# EAGLE design EIT_Recorder (EAGLE 9.6.2)

## Sheet 1 of 8: ADC_1
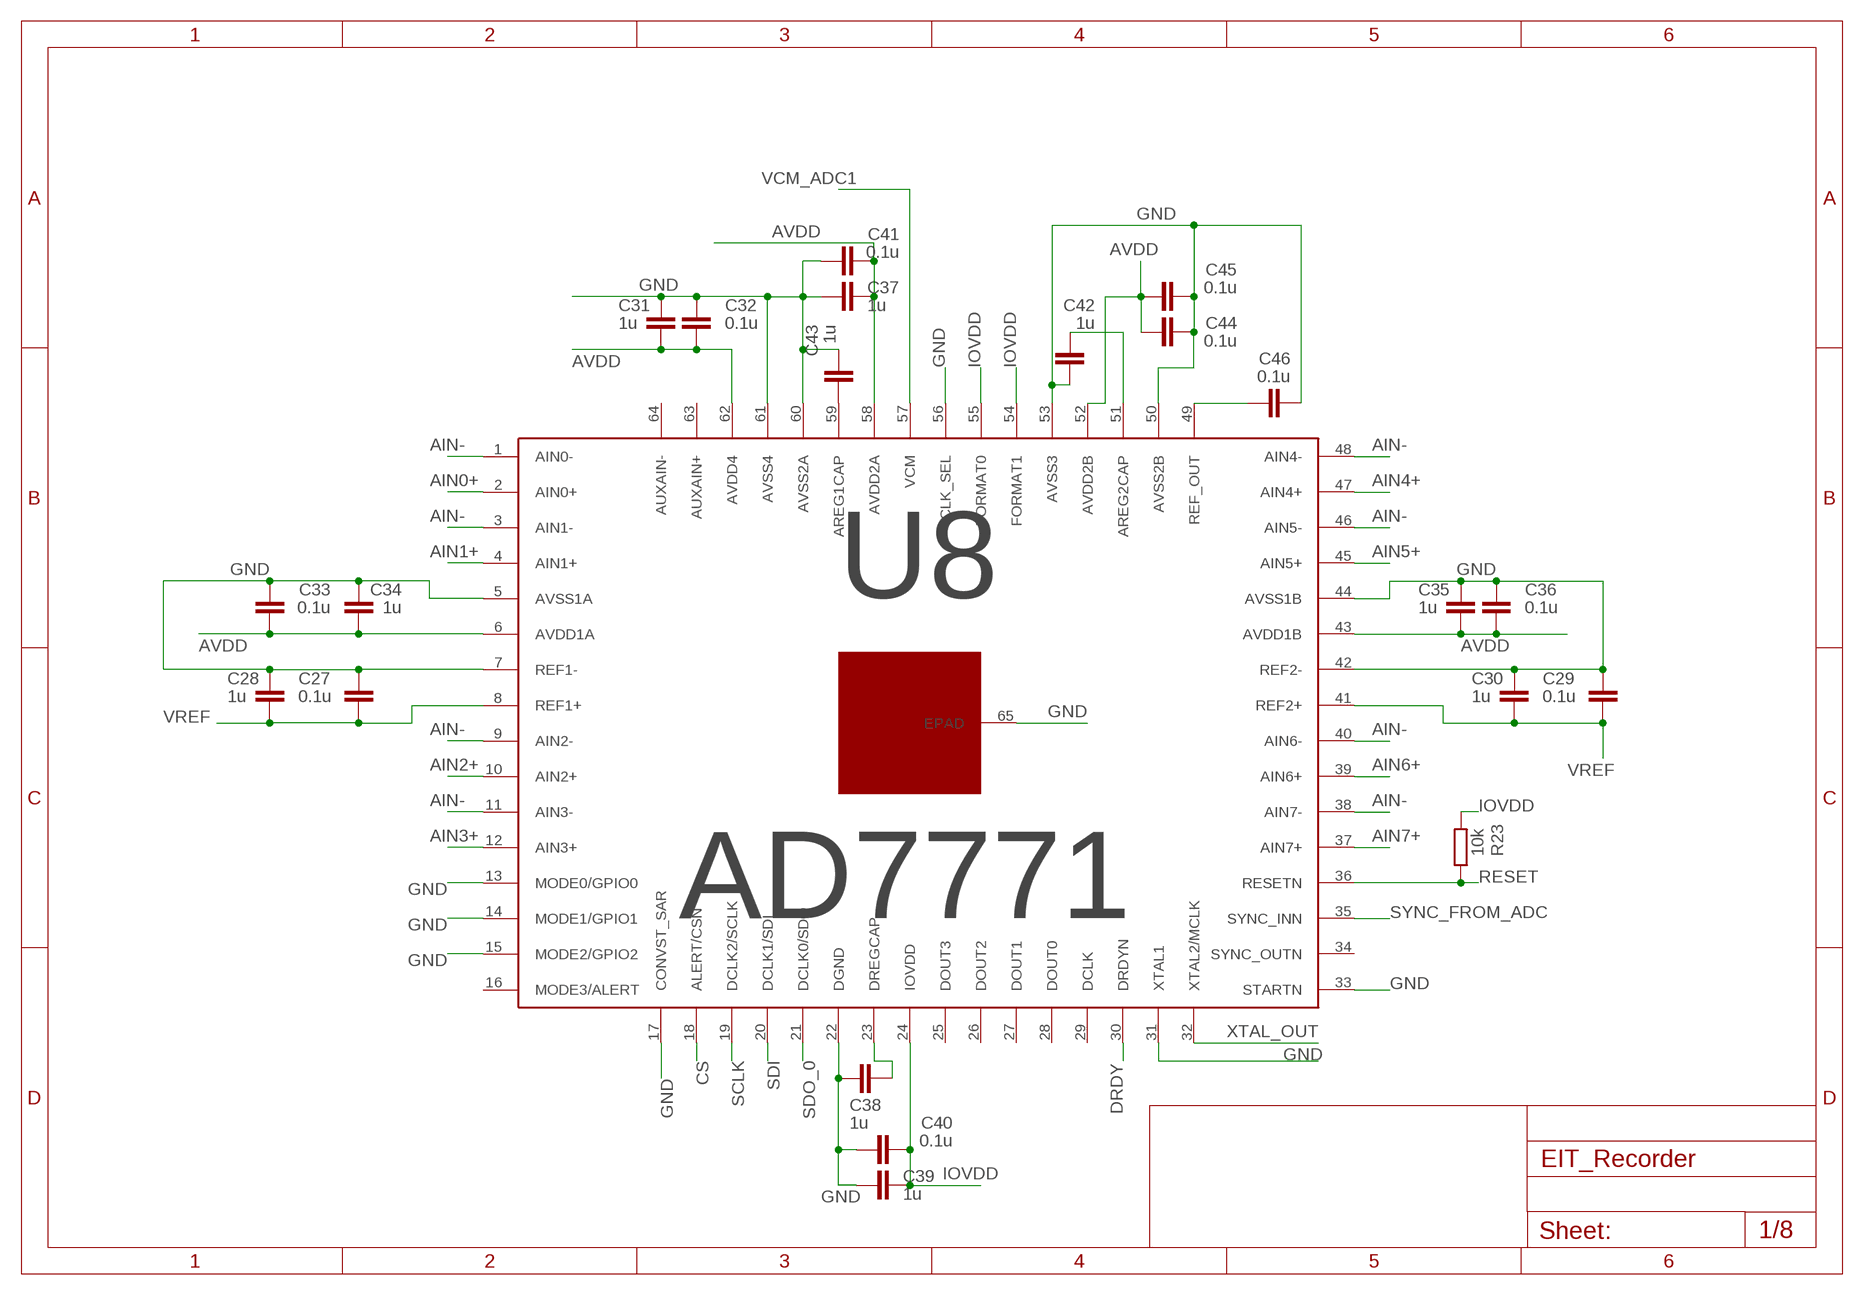
[diagram p0: schematic, sheet 1]

### Parts
C27  0.1u  C0402  [C0402]
C28  1u  C0402  [C0402]
C29  0.1u  C0402  [C0402]
C30  1u  C0402  [C0402]
C31  1u  C0402  [C0402]
C32  0.1u  C0402  [C0402]
C33  0.1u  C0402  [C0402]
C34  1u  C0402  [C0402]
C35  1u  C0402  [C0402]
C36  0.1u  C0402  [C0402]
C37  1u  C0402  [C0402]
C38  1u  C0402  [C0402]
C39  1u  C0402  [C0402]
C40  0.1u  C0402  [C0402]
C41  0.1u  C0402  [C0402]
C42  1u  C0402  [C0402]
C43  1u  C0402  [C0402]
C44  0.1u  C0402  [C0402]
C45  0.1u  C0402  [C0402]
C46  0.1u  C0402  [C0402]
R23  10k  R0603  [R0603]
U8  AD7771  [LFCSP64_CUSTOM]

### Nets
AIN0+: U8.2(AIN0+) ; also sheet 7
AIN1+: U8.4(AIN1+) ; also sheet 7
AIN2+: U8.10(AIN2+) ; also sheet 7
AIN3+: U8.12(AIN3+) ; also sheet 7
AIN4+: U8.47(AIN4+) ; also sheet 7
AIN5+: U8.45(AIN5+) ; also sheet 7
AIN6+: U8.39(AIN6+) ; also sheet 7
AIN7+: U8.37(AIN7+) ; also sheet 7
AIN-: U8.1(AIN0-) U8.3(AIN1-) U8.9(AIN2-) U8.11(AIN3-) U8.38(AIN7-) U8.40(AIN6-) U8.46(AIN5-) U8.48(AIN4-) ; also sheet 2,3,4,7
AVDD: C31.1 C32.1 C33.1 C34.1 C35.1 C36.1 C37.1 C41.1 C44.2 C45.2 U8.6(AVDD1A) U8.43(AVDD1B) U8.52(AVDD2B) U8.58(AVDD2A) U8.62(AVDD4) ; also sheet 2,3,4,5
CS: U8.18(ALERT/CSN) ; also sheet 2,3,4,8
DRDY: U8.30(DRDYN) ; also sheet 8
GND: C27.2 C28.2 C29.2 C30.2 C31.2 C32.2 C33.2 C34.2 C35.2 C36.2 C37.2 C38.1 C39.2 C40.2 C41.2 C42.2 C43.1 C44.1 C45.1 C46.1 U8.5(AVSS1A) U8.7(REF1-) U8.13(MODE0/GPIO0) U8.14(MODE1/GPIO1) U8.15(MODE2/GPIO2) U8.17(CONVST_SAR) U8.22(DGND) U8.31(XTAL1) U8.33(STARTN) U8.42(REF2-) U8.44(AVSS1B) U8.50(AVSS2B) U8.53(AVSS3) U8.56(CLK_SEL) U8.60(AVSS2A) U8.61(AVSS4) U8.65(EPAD) ; also sheet 2,3,4,5,6,7,8
IOVDD: C39.1 C40.1 R23.2 U8.24(IOVDD) U8.54(FORMAT1) U8.55(FORMAT0) ; also sheet 2,3,4,5,6,8
N$41: C43.2 U8.59(AREG1CAP)
N$43: C38.2 U8.23(DREGCAP)
N$44: C46.2 U8.49(REF_OUT)
N$47: C42.1 U8.51(AREG2CAP)
RESET: R23.1 U8.36(RESETN) ; also sheet 2,3,4,8
SCLK: U8.19(DCLK2/SCLK) ; also sheet 2,3,4,8
SDI: U8.20(DCLK1/SDI) ; also sheet 2,3,4,8
SDO_0: U8.21(DCLK0/SDO) ; also sheet 8
SYNC_FROM_ADC: U8.35(SYNC_INN) ; also sheet 2,3,4
VCM_ADC1: U8.57(VCM) ; also sheet 7
VREF: C27.1 C28.1 C29.1 C30.1 U8.8(REF1+) U8.41(REF2+) ; also sheet 2,3,4,7
XTAL_OUT: U8.32(XTAL2/MCLK) ; also sheet 2,3,4,6
Unconnected: U8.16(MODE3/ALERT) U8.25(DOUT3) U8.26(DOUT2) U8.27(DOUT1) U8.28(DOUT0) U8.29(DCLK) U8.34(SYNC_OUTN) U8.63(AUXAIN+) U8.64(AUXAIN-)

## Sheet 2 of 8: ADC_2
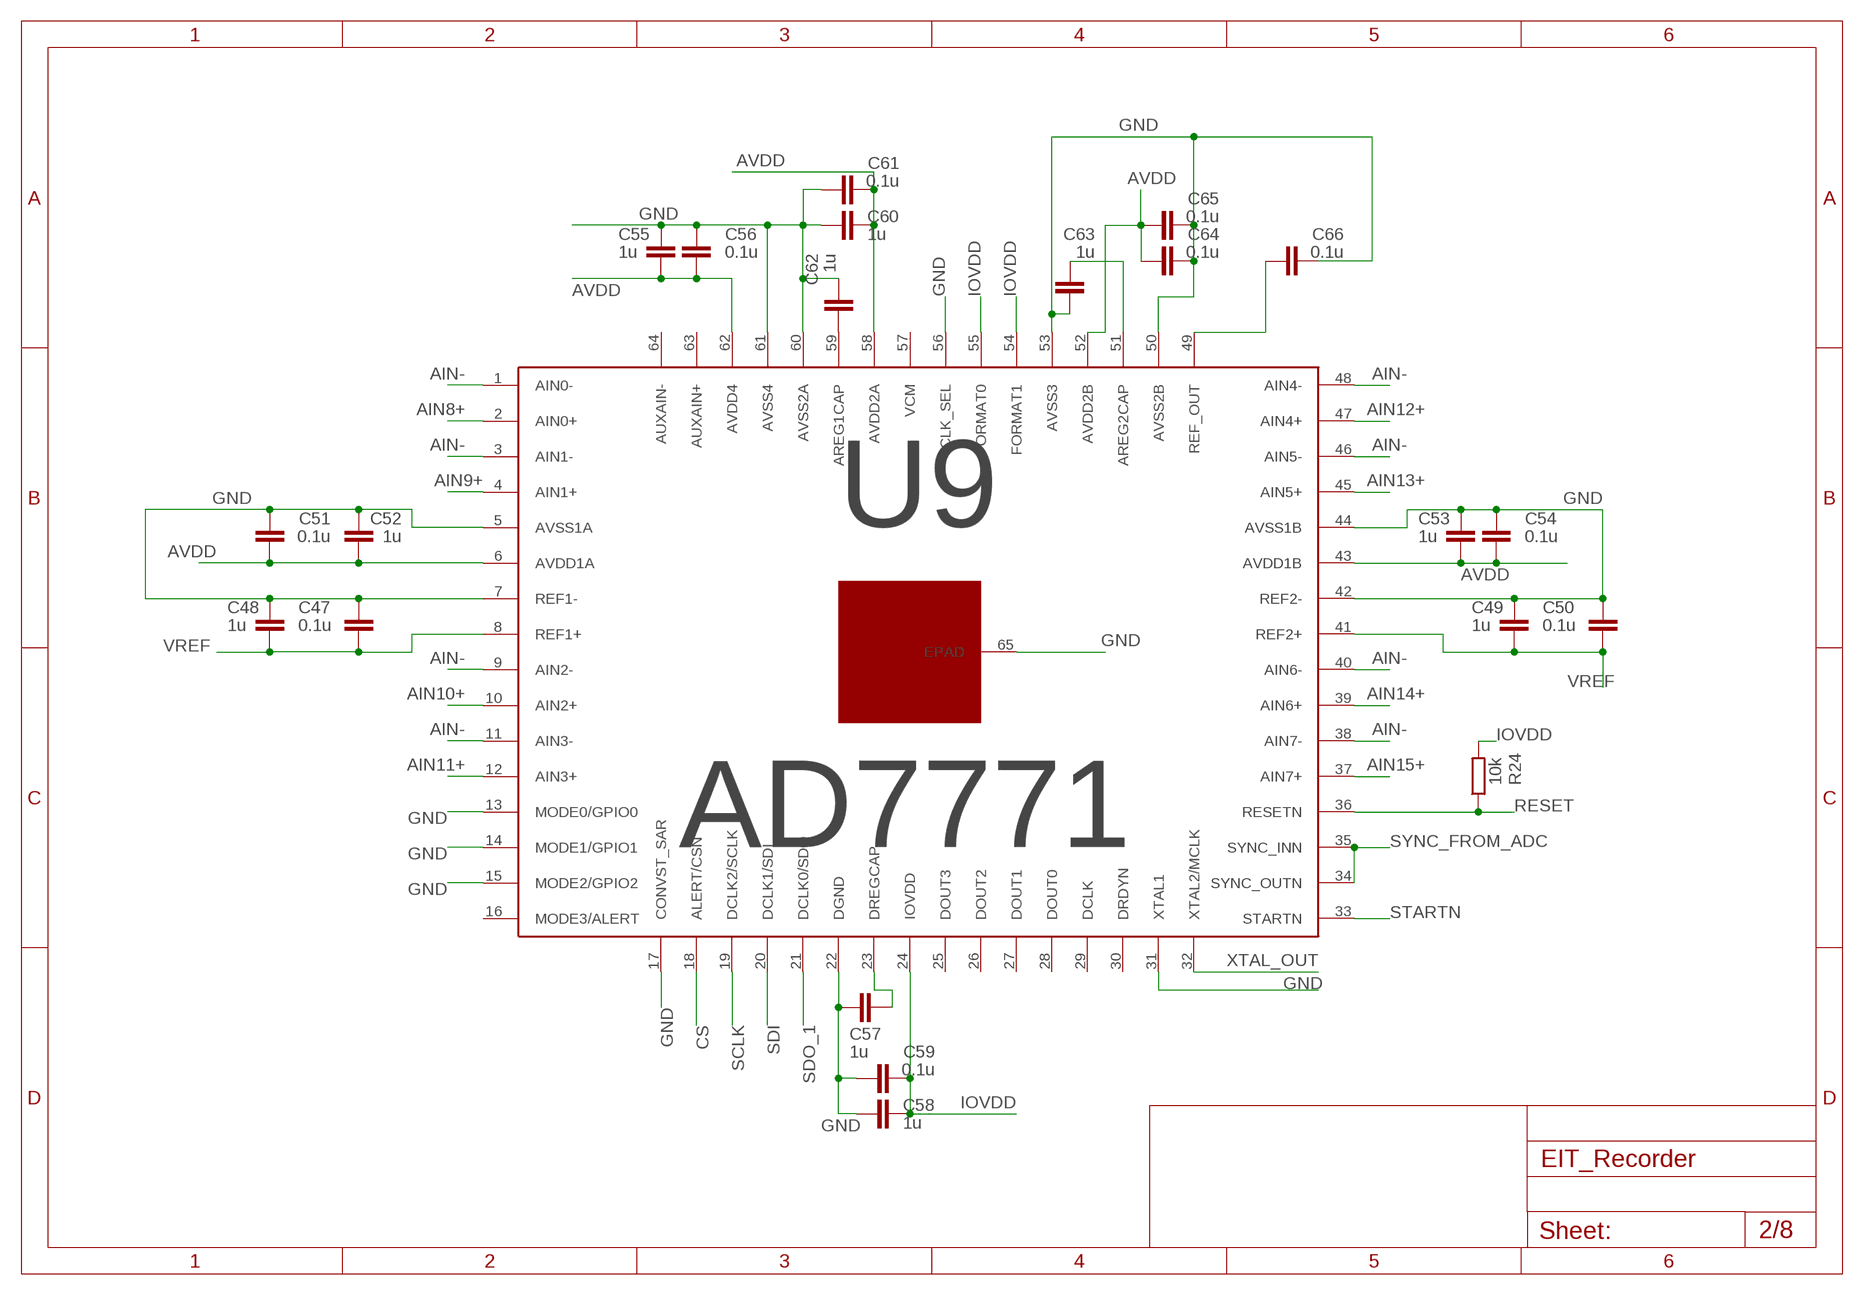
[diagram p1: schematic, sheet 2]

### Parts
C47  0.1u  C0402  [C0402]
C48  1u  C0402  [C0402]
C49  1u  C0402  [C0402]
C50  0.1u  C0402  [C0402]
C51  0.1u  C0402  [C0402]
C52  1u  C0402  [C0402]
C53  1u  C0402  [C0402]
C54  0.1u  C0402  [C0402]
C55  1u  C0402  [C0402]
C56  0.1u  C0402  [C0402]
C57  1u  C0402  [C0402]
C58  1u  C0402  [C0402]
C59  0.1u  C0402  [C0402]
C60  1u  C0402  [C0402]
C61  0.1u  C0402  [C0402]
C62  1u  C0402  [C0402]
C63  1u  C0402  [C0402]
C64  0.1u  C0402  [C0402]
C65  0.1u  C0402  [C0402]
C66  0.1u  C0402  [C0402]
R24  10k  R0603  [R0603]
U9  AD7771  [LFCSP64_CUSTOM]

### Nets
AIN8+: U9.2(AIN0+) ; also sheet 7
AIN9+: U9.4(AIN1+) ; also sheet 7
AIN10+: U9.10(AIN2+) ; also sheet 7
AIN11+: U9.12(AIN3+) ; also sheet 7
AIN12+: U9.47(AIN4+) ; also sheet 7
AIN13+: U9.45(AIN5+) ; also sheet 7
AIN14+: U9.39(AIN6+) ; also sheet 7
AIN15+: U9.37(AIN7+) ; also sheet 7
AIN-: U9.1(AIN0-) U9.3(AIN1-) U9.9(AIN2-) U9.11(AIN3-) U9.38(AIN7-) U9.40(AIN6-) U9.46(AIN5-) U9.48(AIN4-) ; also sheet 1,3,4,7
AVDD: C51.1 C52.1 C53.1 C54.1 C55.1 C56.1 C60.1 C61.1 C64.2 C65.2 U9.6(AVDD1A) U9.43(AVDD1B) U9.52(AVDD2B) U9.58(AVDD2A) U9.62(AVDD4) ; also sheet 1,3,4,5
CS: U9.18(ALERT/CSN) ; also sheet 1,3,4,8
GND: C47.2 C48.2 C49.2 C50.2 C51.2 C52.2 C53.2 C54.2 C55.2 C56.2 C57.1 C58.2 C59.2 C60.2 C61.2 C62.1 C63.2 C64.1 C65.1 C66.1 U9.5(AVSS1A) U9.7(REF1-) U9.13(MODE0/GPIO0) U9.14(MODE1/GPIO1) U9.15(MODE2/GPIO2) U9.17(CONVST_SAR) U9.22(DGND) U9.31(XTAL1) U9.42(REF2-) U9.44(AVSS1B) U9.50(AVSS2B) U9.53(AVSS3) U9.56(CLK_SEL) U9.60(AVSS2A) U9.61(AVSS4) U9.65(EPAD) ; also sheet 1,3,4,5,6,7,8
IOVDD: C58.1 C59.1 R24.2 U9.24(IOVDD) U9.54(FORMAT1) U9.55(FORMAT0) ; also sheet 1,3,4,5,6,8
N$39: C57.2 U9.23(DREGCAP)
N$57: C62.2 U9.59(AREG1CAP)
N$61: C63.1 U9.51(AREG2CAP)
N$64: C66.2 U9.49(REF_OUT)
RESET: R24.1 U9.36(RESETN) ; also sheet 1,3,4,8
SCLK: U9.19(DCLK2/SCLK) ; also sheet 1,3,4,8
SDI: U9.20(DCLK1/SDI) ; also sheet 1,3,4,8
SDO_1: U9.21(DCLK0/SDO) ; also sheet 8
STARTN: U9.33(STARTN) ; also sheet 8
SYNC_FROM_ADC: U9.34(SYNC_OUTN) U9.35(SYNC_INN) ; also sheet 1,3,4
VREF: C47.1 C48.1 C49.1 C50.1 U9.8(REF1+) U9.41(REF2+) ; also sheet 1,3,4,7
XTAL_OUT: U9.32(XTAL2/MCLK) ; also sheet 1,3,4,6
Unconnected: U9.16(MODE3/ALERT) U9.25(DOUT3) U9.26(DOUT2) U9.27(DOUT1) U9.28(DOUT0) U9.29(DCLK) U9.30(DRDYN) U9.57(VCM) U9.63(AUXAIN+) U9.64(AUXAIN-)

## Sheet 3 of 8: ADC_3
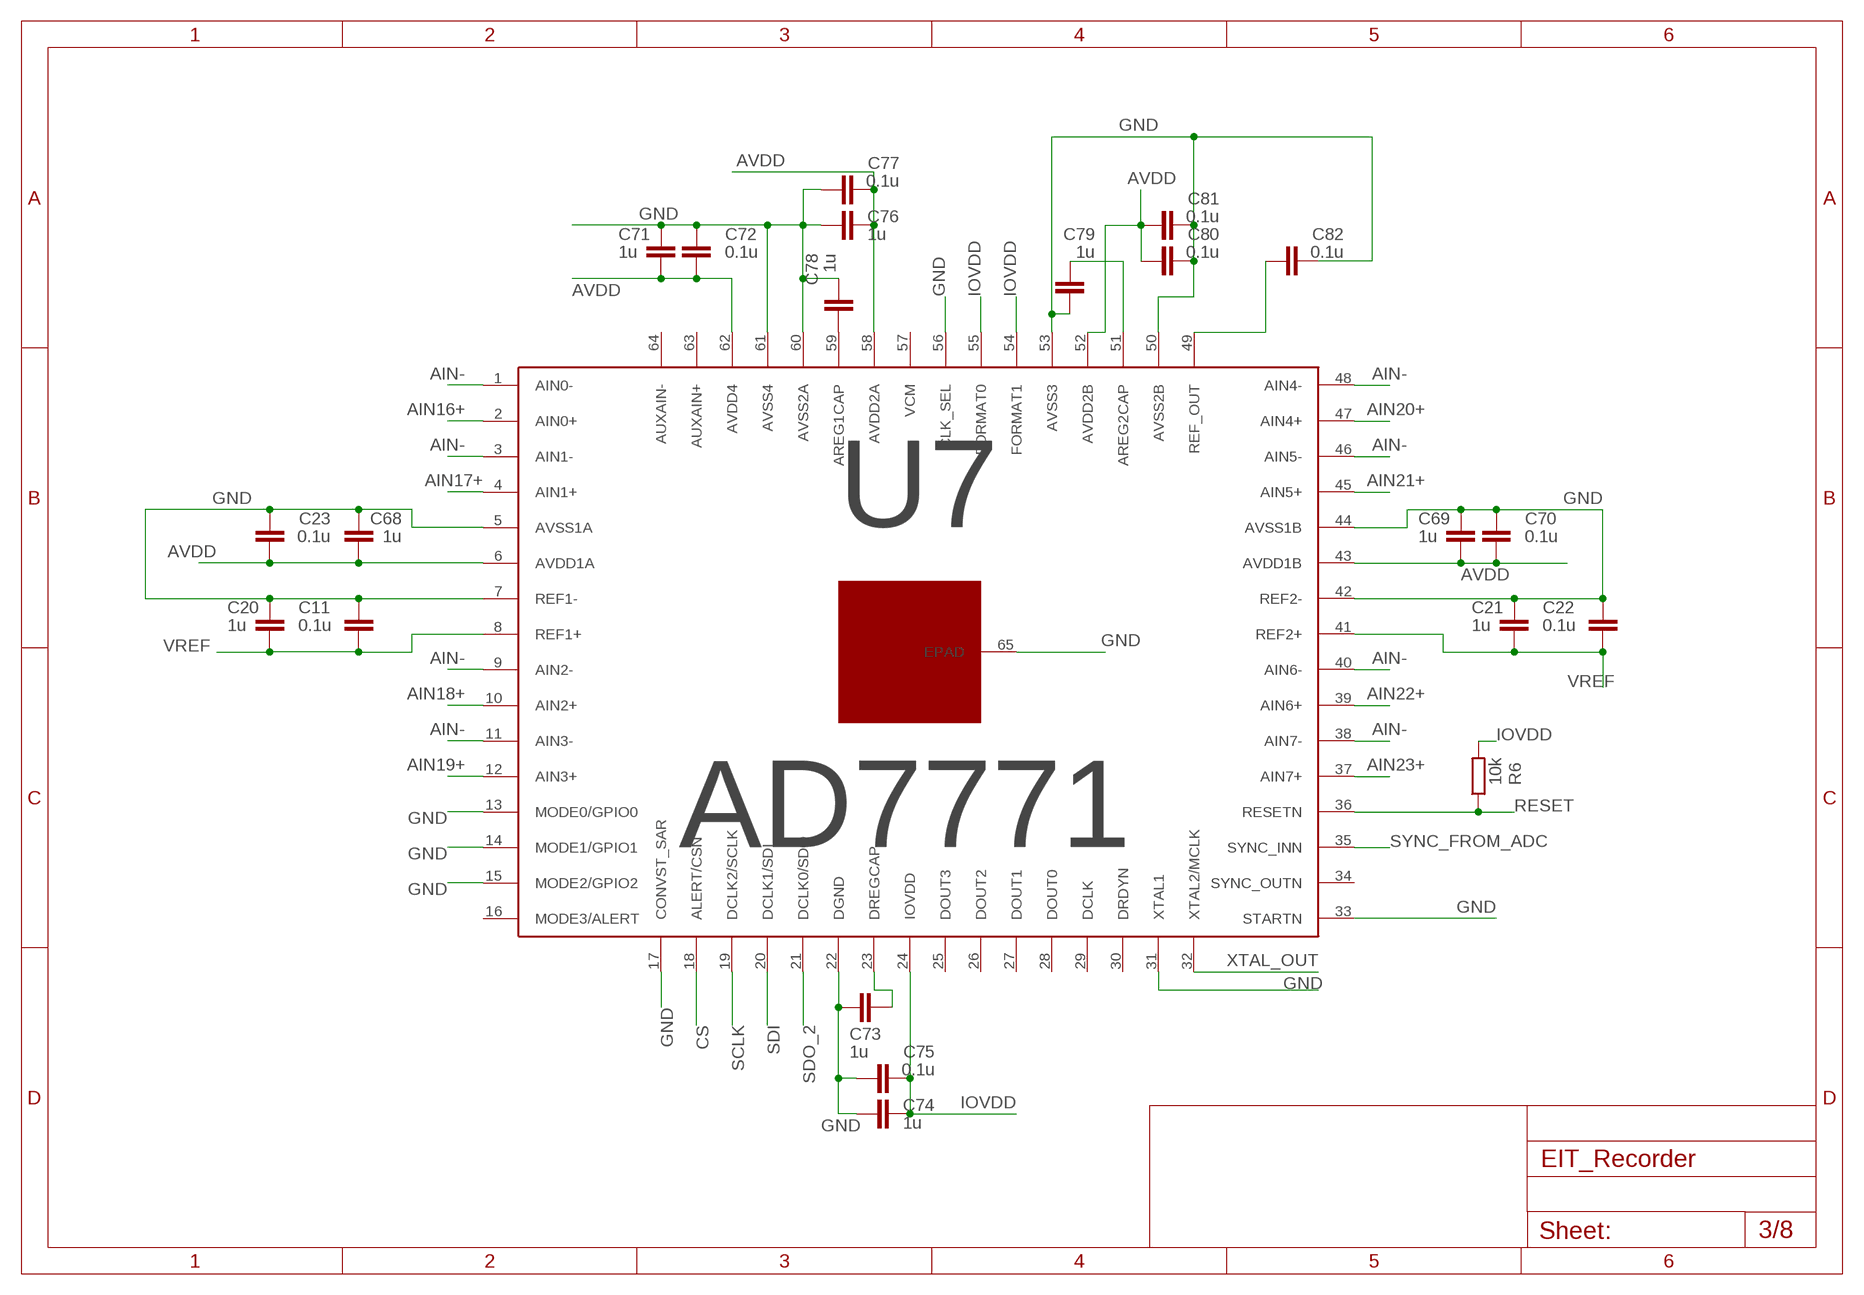
[diagram p2: schematic, sheet 3]

### Parts
C11  0.1u  C0402  [C0402]
C20  1u  C0402  [C0402]
C21  1u  C0402  [C0402]
C22  0.1u  C0402  [C0402]
C23  0.1u  C0402  [C0402]
C68  1u  C0402  [C0402]
C69  1u  C0402  [C0402]
C70  0.1u  C0402  [C0402]
C71  1u  C0402  [C0402]
C72  0.1u  C0402  [C0402]
C73  1u  C0402  [C0402]
C74  1u  C0402  [C0402]
C75  0.1u  C0402  [C0402]
C76  1u  C0402  [C0402]
C77  0.1u  C0402  [C0402]
C78  1u  C0402  [C0402]
C79  1u  C0402  [C0402]
C80  0.1u  C0402  [C0402]
C81  0.1u  C0402  [C0402]
C82  0.1u  C0402  [C0402]
R6  10k  R0603  [R0603]
U7  AD7771  [LFCSP64_CUSTOM]

### Nets
AIN16+: U7.2(AIN0+) ; also sheet 7
AIN17+: U7.4(AIN1+) ; also sheet 7
AIN18+: U7.10(AIN2+) ; also sheet 7
AIN19+: U7.12(AIN3+) ; also sheet 7
AIN20+: U7.47(AIN4+) ; also sheet 7
AIN21+: U7.45(AIN5+) ; also sheet 7
AIN22+: U7.39(AIN6+) ; also sheet 7
AIN23+: U7.37(AIN7+) ; also sheet 7
AIN-: U7.1(AIN0-) U7.3(AIN1-) U7.9(AIN2-) U7.11(AIN3-) U7.38(AIN7-) U7.40(AIN6-) U7.46(AIN5-) U7.48(AIN4-) ; also sheet 1,2,4,7
AVDD: C23.1 C68.1 C69.1 C70.1 C71.1 C72.1 C76.1 C77.1 C80.2 C81.2 U7.6(AVDD1A) U7.43(AVDD1B) U7.52(AVDD2B) U7.58(AVDD2A) U7.62(AVDD4) ; also sheet 1,2,4,5
CS: U7.18(ALERT/CSN) ; also sheet 1,2,4,8
GND: C11.2 C20.2 C21.2 C22.2 C23.2 C68.2 C69.2 C70.2 C71.2 C72.2 C73.1 C74.2 C75.2 C76.2 C77.2 C78.1 C79.2 C80.1 C81.1 C82.1 U7.5(AVSS1A) U7.7(REF1-) U7.13(MODE0/GPIO0) U7.14(MODE1/GPIO1) U7.15(MODE2/GPIO2) U7.17(CONVST_SAR) U7.22(DGND) U7.31(XTAL1) U7.33(STARTN) U7.42(REF2-) U7.44(AVSS1B) U7.50(AVSS2B) U7.53(AVSS3) U7.56(CLK_SEL) U7.60(AVSS2A) U7.61(AVSS4) U7.65(EPAD) ; also sheet 1,2,4,5,6,7,8
IOVDD: C74.1 C75.1 R6.2 U7.24(IOVDD) U7.54(FORMAT1) U7.55(FORMAT0) ; also sheet 1,2,4,5,6,8
N$15: C73.2 U7.23(DREGCAP)
N$16: C78.2 U7.59(AREG1CAP)
N$17: C79.1 U7.51(AREG2CAP)
N$18: C82.2 U7.49(REF_OUT)
RESET: R6.1 U7.36(RESETN) ; also sheet 1,2,4,8
SCLK: U7.19(DCLK2/SCLK) ; also sheet 1,2,4,8
SDI: U7.20(DCLK1/SDI) ; also sheet 1,2,4,8
SDO_2: U7.21(DCLK0/SDO) ; also sheet 8
SYNC_FROM_ADC: U7.35(SYNC_INN) ; also sheet 1,2,4
VREF: C11.1 C20.1 C21.1 C22.1 U7.8(REF1+) U7.41(REF2+) ; also sheet 1,2,4,7
XTAL_OUT: U7.32(XTAL2/MCLK) ; also sheet 1,2,4,6
Unconnected: U7.16(MODE3/ALERT) U7.25(DOUT3) U7.26(DOUT2) U7.27(DOUT1) U7.28(DOUT0) U7.29(DCLK) U7.30(DRDYN) U7.34(SYNC_OUTN) U7.57(VCM) U7.63(AUXAIN+) U7.64(AUXAIN-)

## Sheet 4 of 8: ADC_4
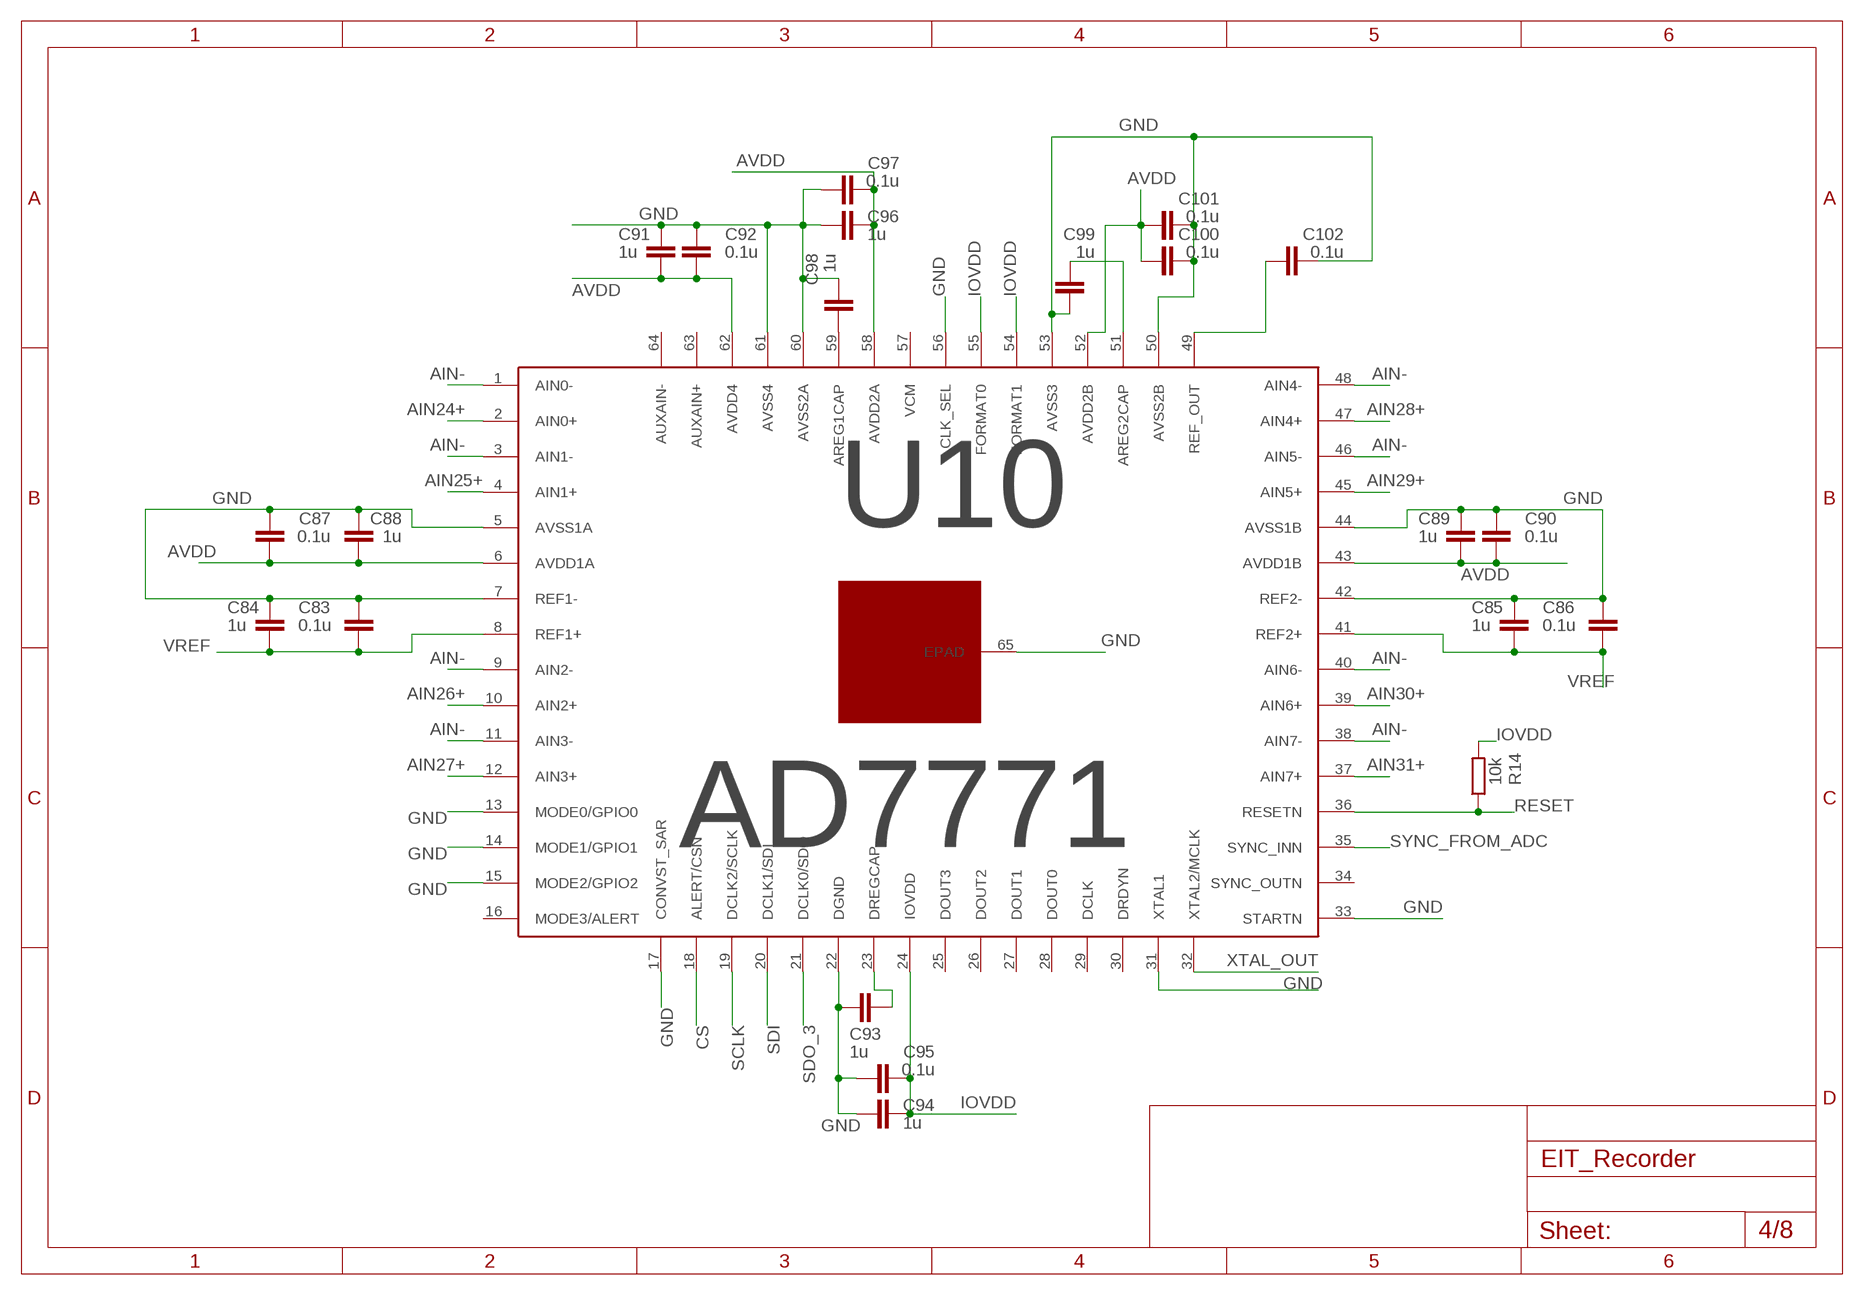
[diagram p3: schematic, sheet 4]

### Parts
C83  0.1u  C0402  [C0402]
C84  1u  C0402  [C0402]
C85  1u  C0402  [C0402]
C86  0.1u  C0402  [C0402]
C87  0.1u  C0402  [C0402]
C88  1u  C0402  [C0402]
C89  1u  C0402  [C0402]
C90  0.1u  C0402  [C0402]
C91  1u  C0402  [C0402]
C92  0.1u  C0402  [C0402]
C93  1u  C0402  [C0402]
C94  1u  C0402  [C0402]
C95  0.1u  C0402  [C0402]
C96  1u  C0402  [C0402]
C97  0.1u  C0402  [C0402]
C98  1u  C0402  [C0402]
C99  1u  C0402  [C0402]
C100  0.1u  C0402  [C0402]
C101  0.1u  C0402  [C0402]
C102  0.1u  C0402  [C0402]
R14  10k  R0603  [R0603]
U10  AD7771  [LFCSP64_CUSTOM]

### Nets
AIN24+: U10.2(AIN0+) ; also sheet 7
AIN25+: U10.4(AIN1+) ; also sheet 7
AIN26+: U10.10(AIN2+) ; also sheet 7
AIN27+: U10.12(AIN3+) ; also sheet 7
AIN28+: U10.47(AIN4+) ; also sheet 7
AIN29+: U10.45(AIN5+) ; also sheet 7
AIN30+: U10.39(AIN6+) ; also sheet 7
AIN31+: U10.37(AIN7+) ; also sheet 7
AIN-: U10.1(AIN0-) U10.3(AIN1-) U10.9(AIN2-) U10.11(AIN3-) U10.38(AIN7-) U10.40(AIN6-) U10.46(AIN5-) U10.48(AIN4-) ; also sheet 1,2,3,7
AVDD: C87.1 C88.1 C89.1 C90.1 C91.1 C92.1 C96.1 C97.1 C100.2 C101.2 U10.6(AVDD1A) U10.43(AVDD1B) U10.52(AVDD2B) U10.58(AVDD2A) U10.62(AVDD4) ; also sheet 1,2,3,5
CS: U10.18(ALERT/CSN) ; also sheet 1,2,3,8
GND: C83.2 C84.2 C85.2 C86.2 C87.2 C88.2 C89.2 C90.2 C91.2 C92.2 C93.1 C94.2 C95.2 C96.2 C97.2 C98.1 C99.2 C100.1 C101.1 C102.1 U10.5(AVSS1A) U10.7(REF1-) U10.13(MODE0/GPIO0) U10.14(MODE1/GPIO1) U10.15(MODE2/GPIO2) U10.17(CONVST_SAR) U10.22(DGND) U10.31(XTAL1) U10.33(STARTN) U10.42(REF2-) U10.44(AVSS1B) U10.50(AVSS2B) U10.53(AVSS3) U10.56(CLK_SEL) U10.60(AVSS2A) U10.61(AVSS4) U10.65(EPAD) ; also sheet 1,2,3,5,6,7,8
IOVDD: C94.1 C95.1 R14.2 U10.24(IOVDD) U10.54(FORMAT1) U10.55(FORMAT0) ; also sheet 1,2,3,5,6,8
N$23: C93.2 U10.23(DREGCAP)
N$24: C98.2 U10.59(AREG1CAP)
N$25: C99.1 U10.51(AREG2CAP)
N$27: C102.2 U10.49(REF_OUT)
RESET: R14.1 U10.36(RESETN) ; also sheet 1,2,3,8
SCLK: U10.19(DCLK2/SCLK) ; also sheet 1,2,3,8
SDI: U10.20(DCLK1/SDI) ; also sheet 1,2,3,8
SDO_3: U10.21(DCLK0/SDO) ; also sheet 8
SYNC_FROM_ADC: U10.35(SYNC_INN) ; also sheet 1,2,3
VREF: C83.1 C84.1 C85.1 C86.1 U10.8(REF1+) U10.41(REF2+) ; also sheet 1,2,3,7
XTAL_OUT: U10.32(XTAL2/MCLK) ; also sheet 1,2,3,6
Unconnected: U10.16(MODE3/ALERT) U10.25(DOUT3) U10.26(DOUT2) U10.27(DOUT1) U10.28(DOUT0) U10.29(DCLK) U10.30(DRDYN) U10.34(SYNC_OUTN) U10.57(VCM) U10.63(AUXAIN+) U10.64(AUXAIN-)

## Sheet 5 of 8: POWER_MANAGEMENT_1
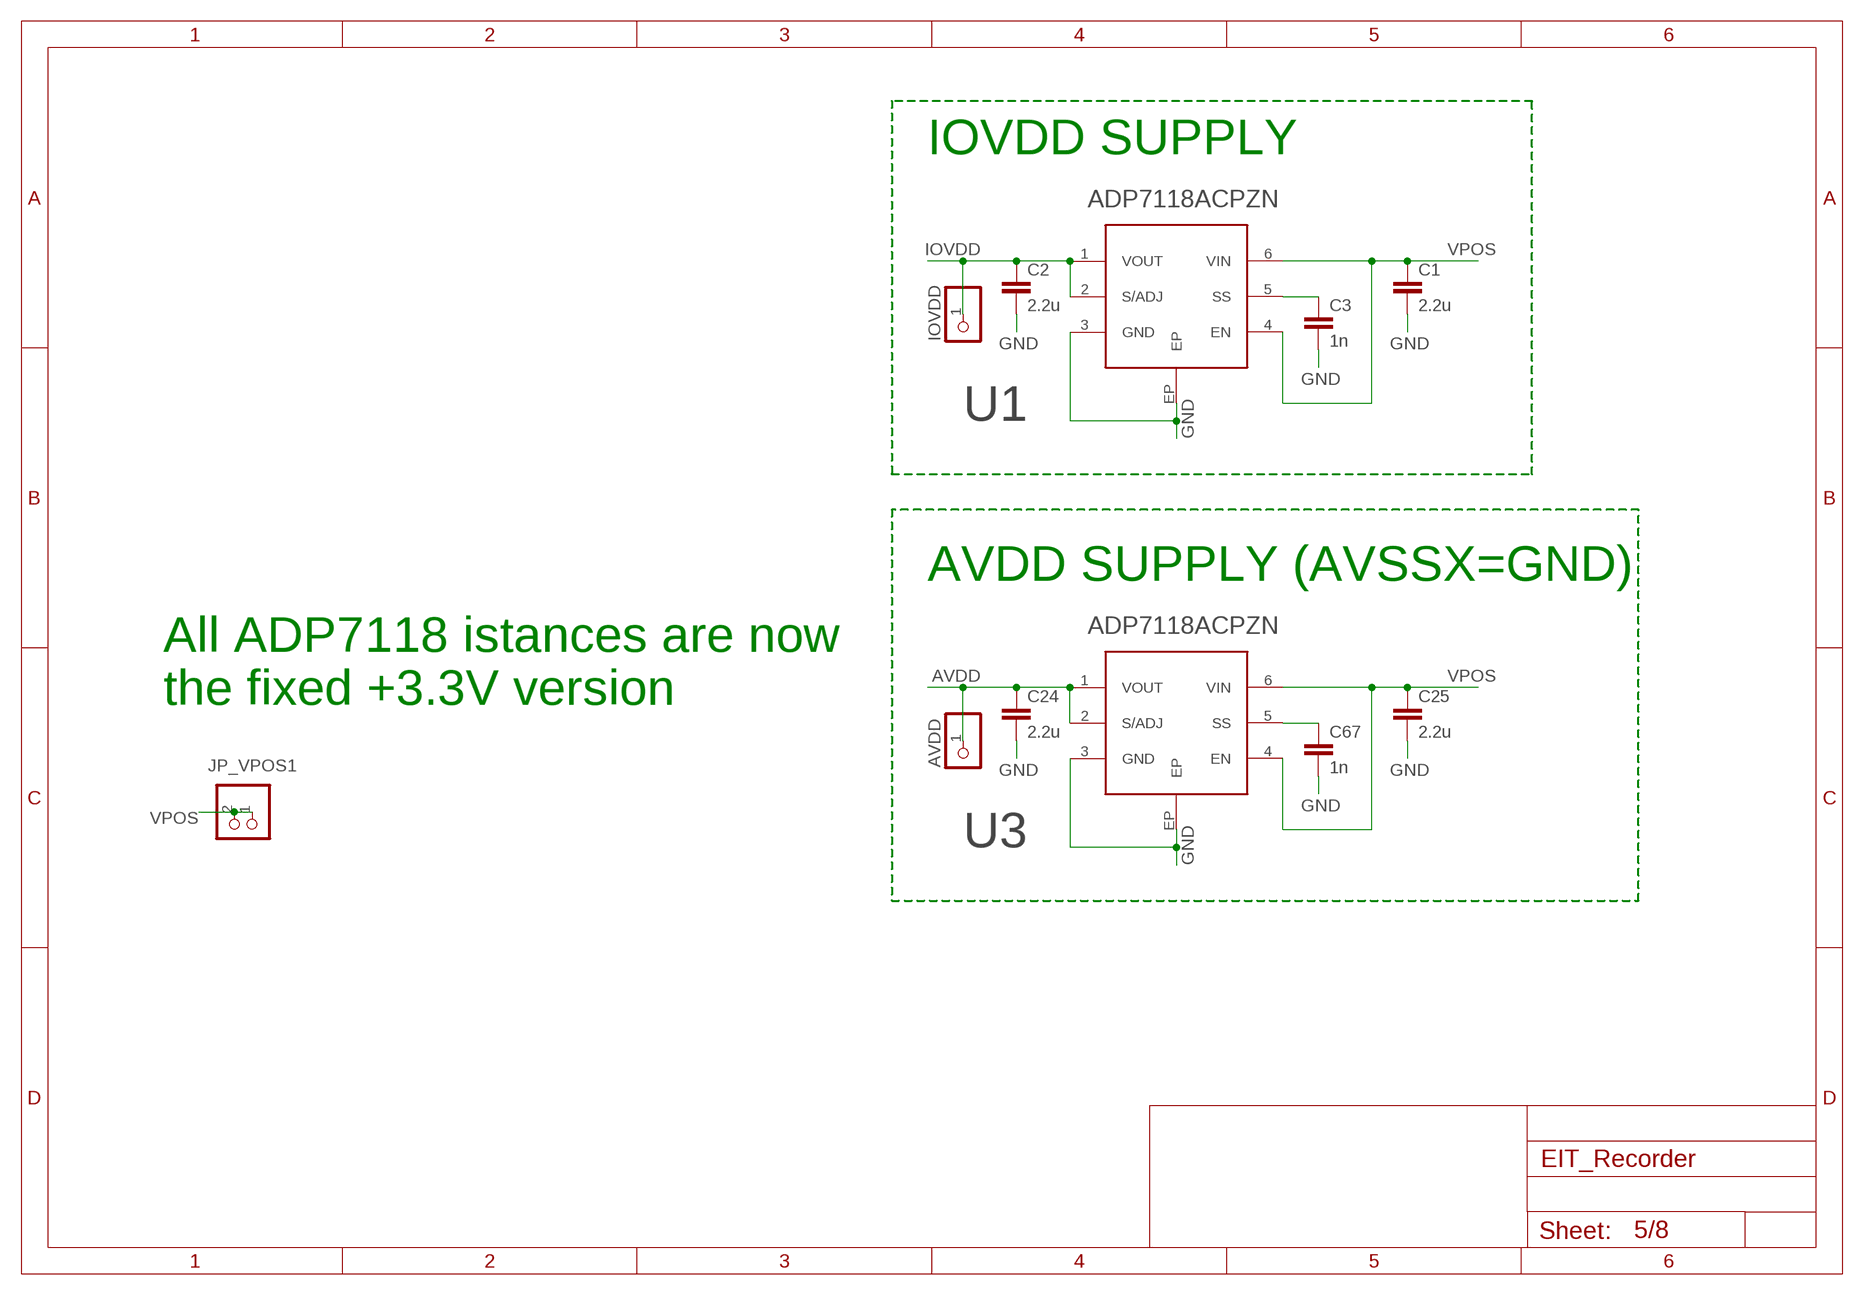
[diagram p4: schematic, sheet 5]

### Parts
AVDD  PINHD-1X1  [1X01]
C1  2.2u  C0603  [C0603]
C2  2.2u  C0603  [C0603]
C3  1n  C0402  [C0402]
C24  2.2u  C0603  [C0603]
C25  2.2u  C0603  [C0603]
C67  1n  C0402  [C0402]
IOVDD  PINHD-1X1  [1X01]
JP_VPOS1  PINHD-1X2  [1X02]
U1  ADP7118ACPZN  [LFCSP6_CUSTOM]
U3  ADP7118ACPZN  [LFCSP6_CUSTOM]

### Nets
AVDD: AVDD.1 C24.1 U3.1(VOUT) U3.2(S/ADJ) ; also sheet 1,2,3,4
GND: C1.2 C2.2 C3.2 C24.2 C25.2 C67.2 U1.3(GND) U1.EP U3.3(GND) U3.EP ; also sheet 1,2,3,4,6,7,8
IOVDD: C2.1 IOVDD.1 U1.1(VOUT) U1.2(S/ADJ) ; also sheet 1,2,3,4,6,8
N$3: C3.1 U1.5(SS)
N$10: C67.1 U3.5(SS)
VPOS: C1.1 C25.1 JP_VPOS1.1 JP_VPOS1.2 U1.4(EN) U1.6(VIN) U3.4(EN) U3.6(VIN) ; also sheet 7

### Notes on the sheet
- IOVDD SUPPLY
- AVDD SUPPLY (AVSSX=GND)
- All ADP7118 istances are now
  the fixed +3.3V version

## Sheet 6 of 8: POWER_MANAGEMENT_2
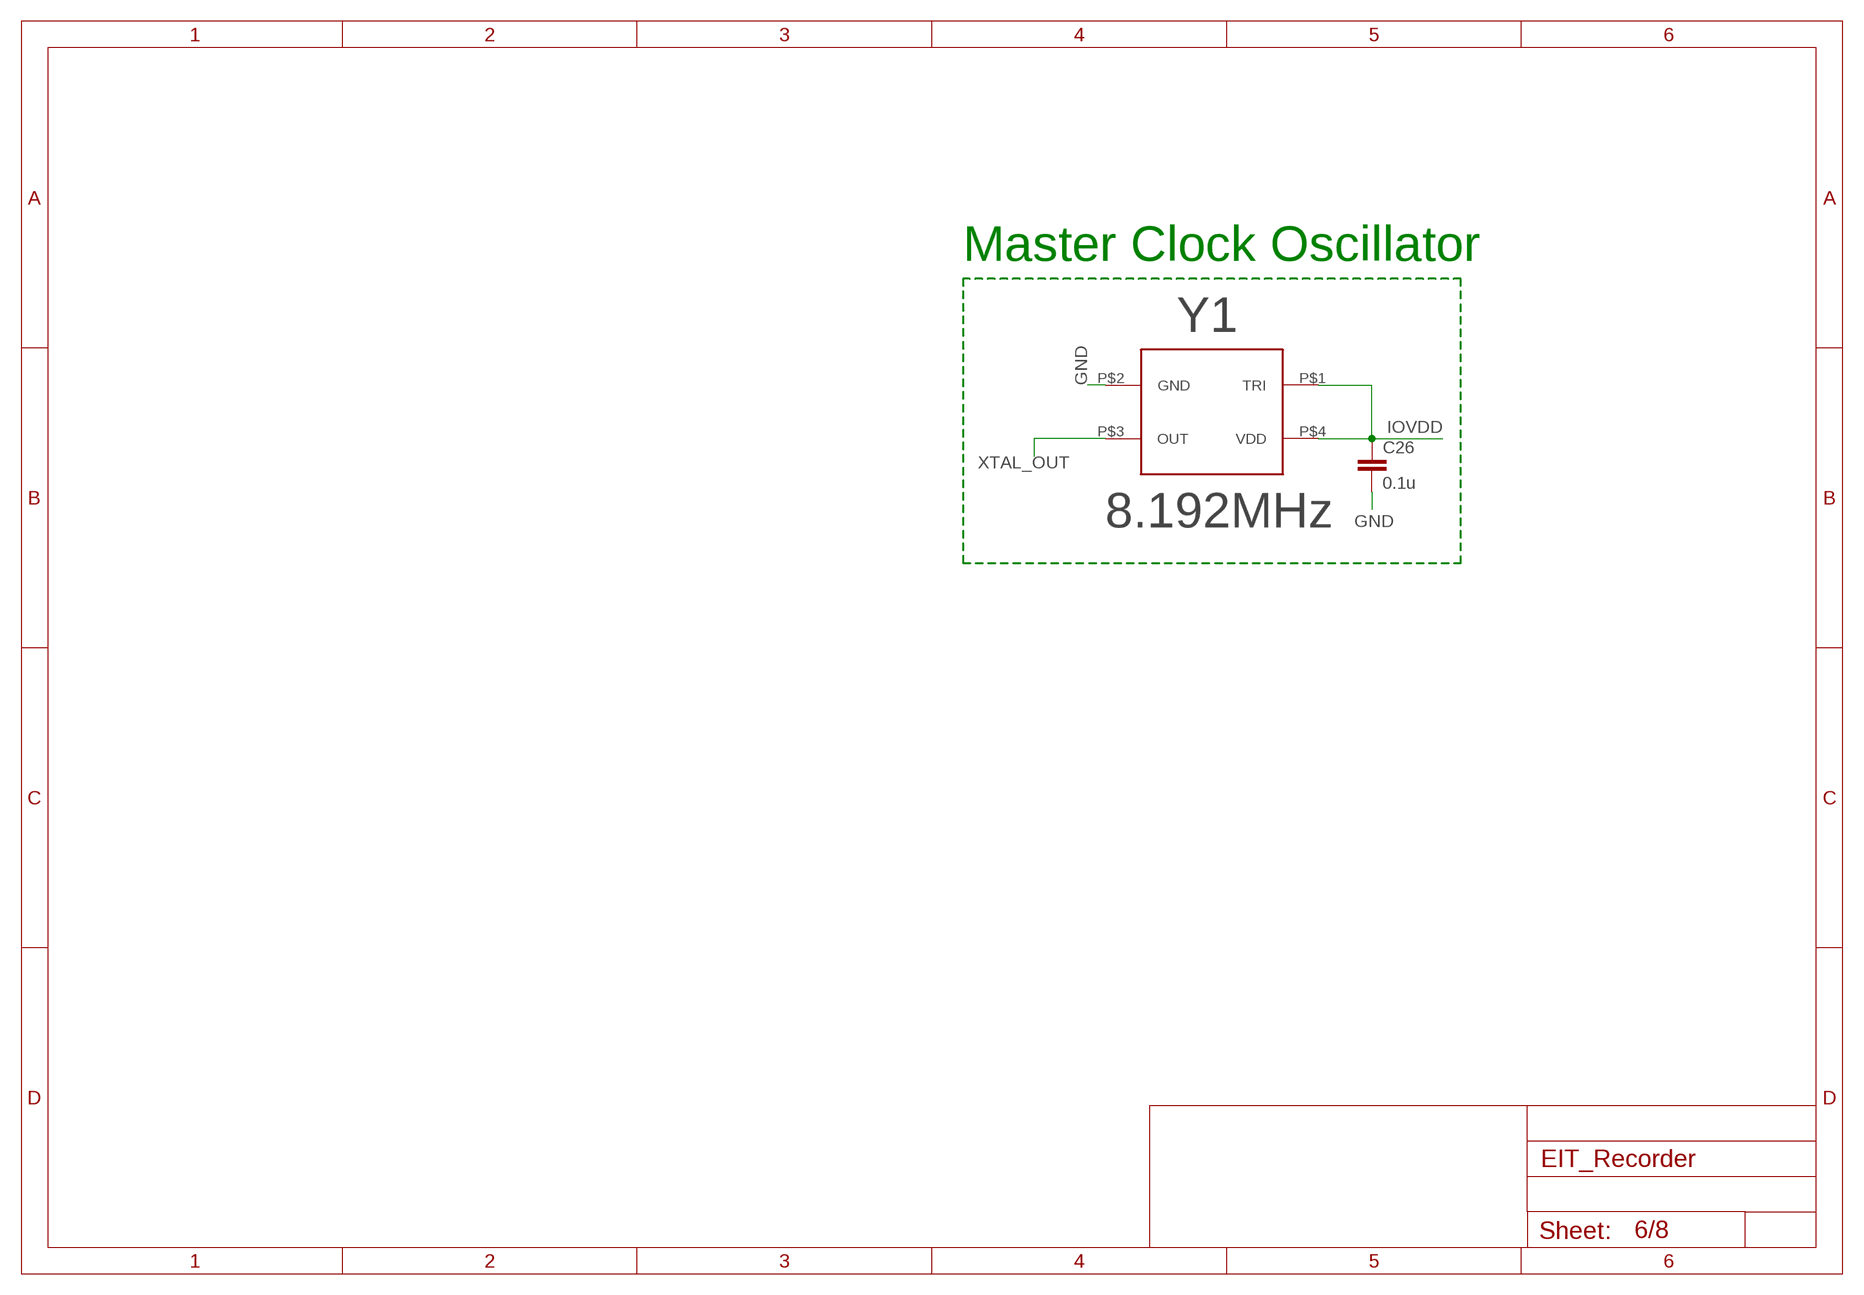
[diagram p5: schematic, sheet 6]

### Parts
C26  0.1u  C0402  [C0402]
Y1  8.192MHz  OSC-ECS-2520MVLC  [ECS-2520MVLC]

### Nets
GND: C26.2 Y1.P$2(GND) ; also sheet 1,2,3,4,5,7,8
IOVDD: C26.1 Y1.P$1(TRI) Y1.P$4(VDD) ; also sheet 1,2,3,4,5,8
XTAL_OUT: Y1.P$3(OUT) ; also sheet 1,2,3,4

### Notes on the sheet
- Master Clock Oscillator

## Sheet 7 of 8: BUFFERS_AND_VREF
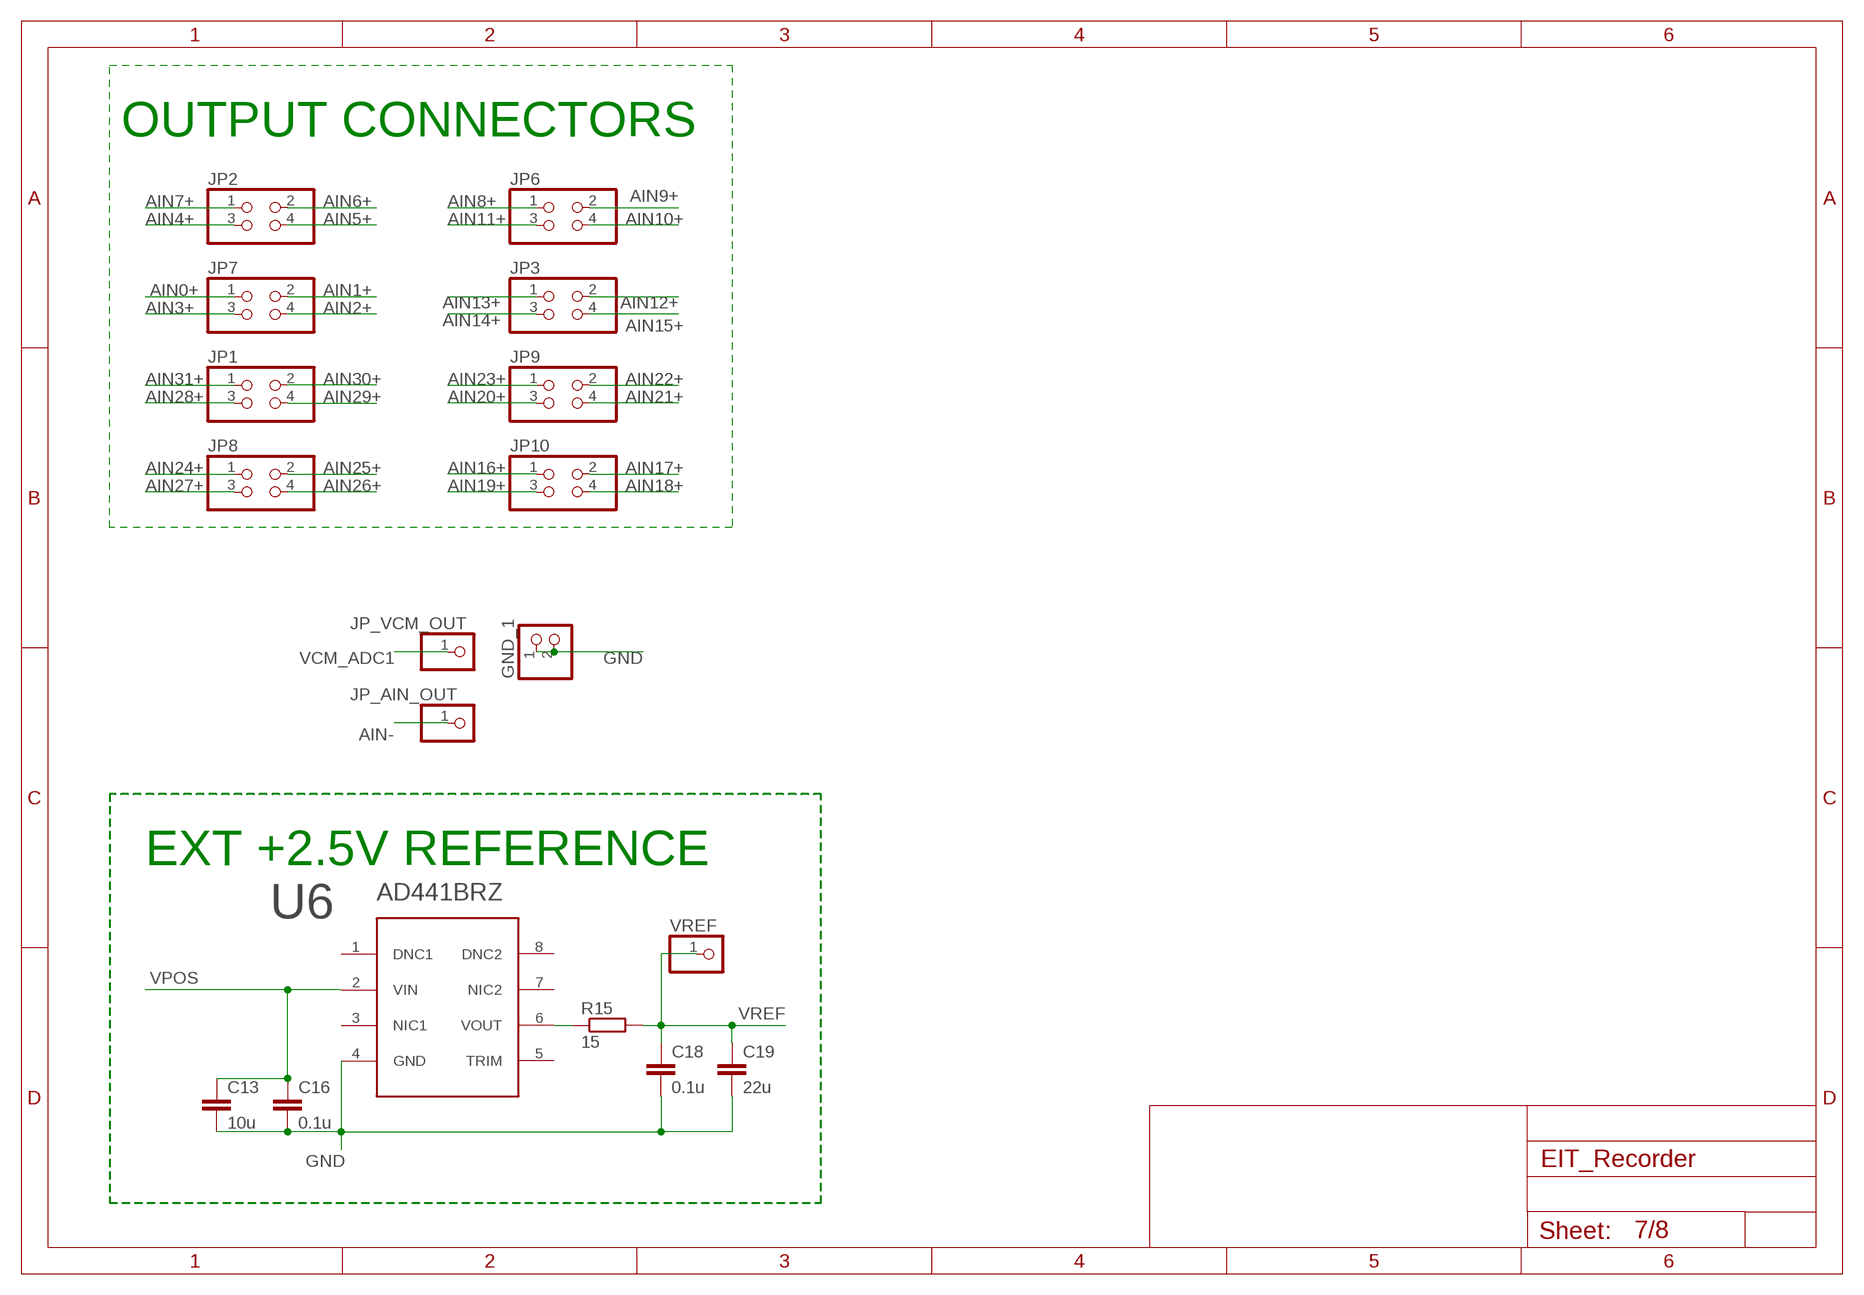
[diagram p6: schematic, sheet 7]

### Parts
C13  10u  C0805  [C0805]
C16  0.1u  C0402  [C0402]
C18  0.1u  C0402  [C0402]
C19  22u  C0805  [C0805]
GND_1  PINHD-1X2  [1X02]
JP1  PINHD-2X2  [2X02]
JP2  PINHD-2X2  [2X02]
JP3  PINHD-2X2  [2X02]
JP6  PINHD-2X2  [2X02]
JP7  PINHD-2X2  [2X02]
JP8  PINHD-2X2  [2X02]
JP9  PINHD-2X2  [2X02]
JP10  PINHD-2X2  [2X02]
JP_AIN_OUT  PINHD-1X1  [1X01]
JP_VCM_OUT  PINHD-1X1  [1X01]
R15  15  R0603  [R0603]
U6  AD441BRZ  [SOIC8N_CUSTOM]
VREF  PINHD-1X1  [1X01]

### Nets
AIN0+: JP7.1 ; also sheet 1
AIN1+: JP7.2 ; also sheet 1
AIN2+: JP7.4 ; also sheet 1
AIN3+: JP7.3 ; also sheet 1
AIN4+: JP2.3 ; also sheet 1
AIN5+: JP2.4 ; also sheet 1
AIN6+: JP2.2 ; also sheet 1
AIN7+: JP2.1 ; also sheet 1
AIN8+: JP6.1 ; also sheet 2
AIN9+: JP6.2 ; also sheet 2
AIN10+: JP6.4 ; also sheet 2
AIN11+: JP6.3 ; also sheet 2
AIN12+: JP3.2 ; also sheet 2
AIN13+: JP3.1 ; also sheet 2
AIN14+: JP3.3 ; also sheet 2
AIN15+: JP3.4 ; also sheet 2
AIN16+: JP10.1 ; also sheet 3
AIN17+: JP10.2 ; also sheet 3
AIN18+: JP10.4 ; also sheet 3
AIN19+: JP10.3 ; also sheet 3
AIN20+: JP9.3 ; also sheet 3
AIN21+: JP9.4 ; also sheet 3
AIN22+: JP9.2 ; also sheet 3
AIN23+: JP9.1 ; also sheet 3
AIN24+: JP8.1 ; also sheet 4
AIN25+: JP8.2 ; also sheet 4
AIN26+: JP8.4 ; also sheet 4
AIN27+: JP8.3 ; also sheet 4
AIN28+: JP1.3 ; also sheet 4
AIN29+: JP1.4 ; also sheet 4
AIN30+: JP1.2 ; also sheet 4
AIN31+: JP1.1 ; also sheet 4
AIN-: JP_AIN_OUT.1 ; also sheet 1,2,3,4
GND: C13.2 C16.2 C18.2 C19.2 GND_1.1 GND_1.2 U6.4(GND) ; also sheet 1,2,3,4,5,6,8
N$26: R15.1 U6.6(VOUT)
VCM_ADC1: JP_VCM_OUT.1 ; also sheet 1
VPOS: C13.1 C16.1 U6.2(VIN) ; also sheet 5
VREF: C18.1 C19.1 R15.2 VREF.1 ; also sheet 1,2,3,4
Unconnected: U6.1(DNC1) U6.3(NIC1) U6.5(TRIM) U6.7(NIC2) U6.8(DNC2)

### Notes on the sheet
- OUTPUT CONNECTORS
- EXT +2.5V REFERENCE

## Sheet 8 of 8: DIGITAL
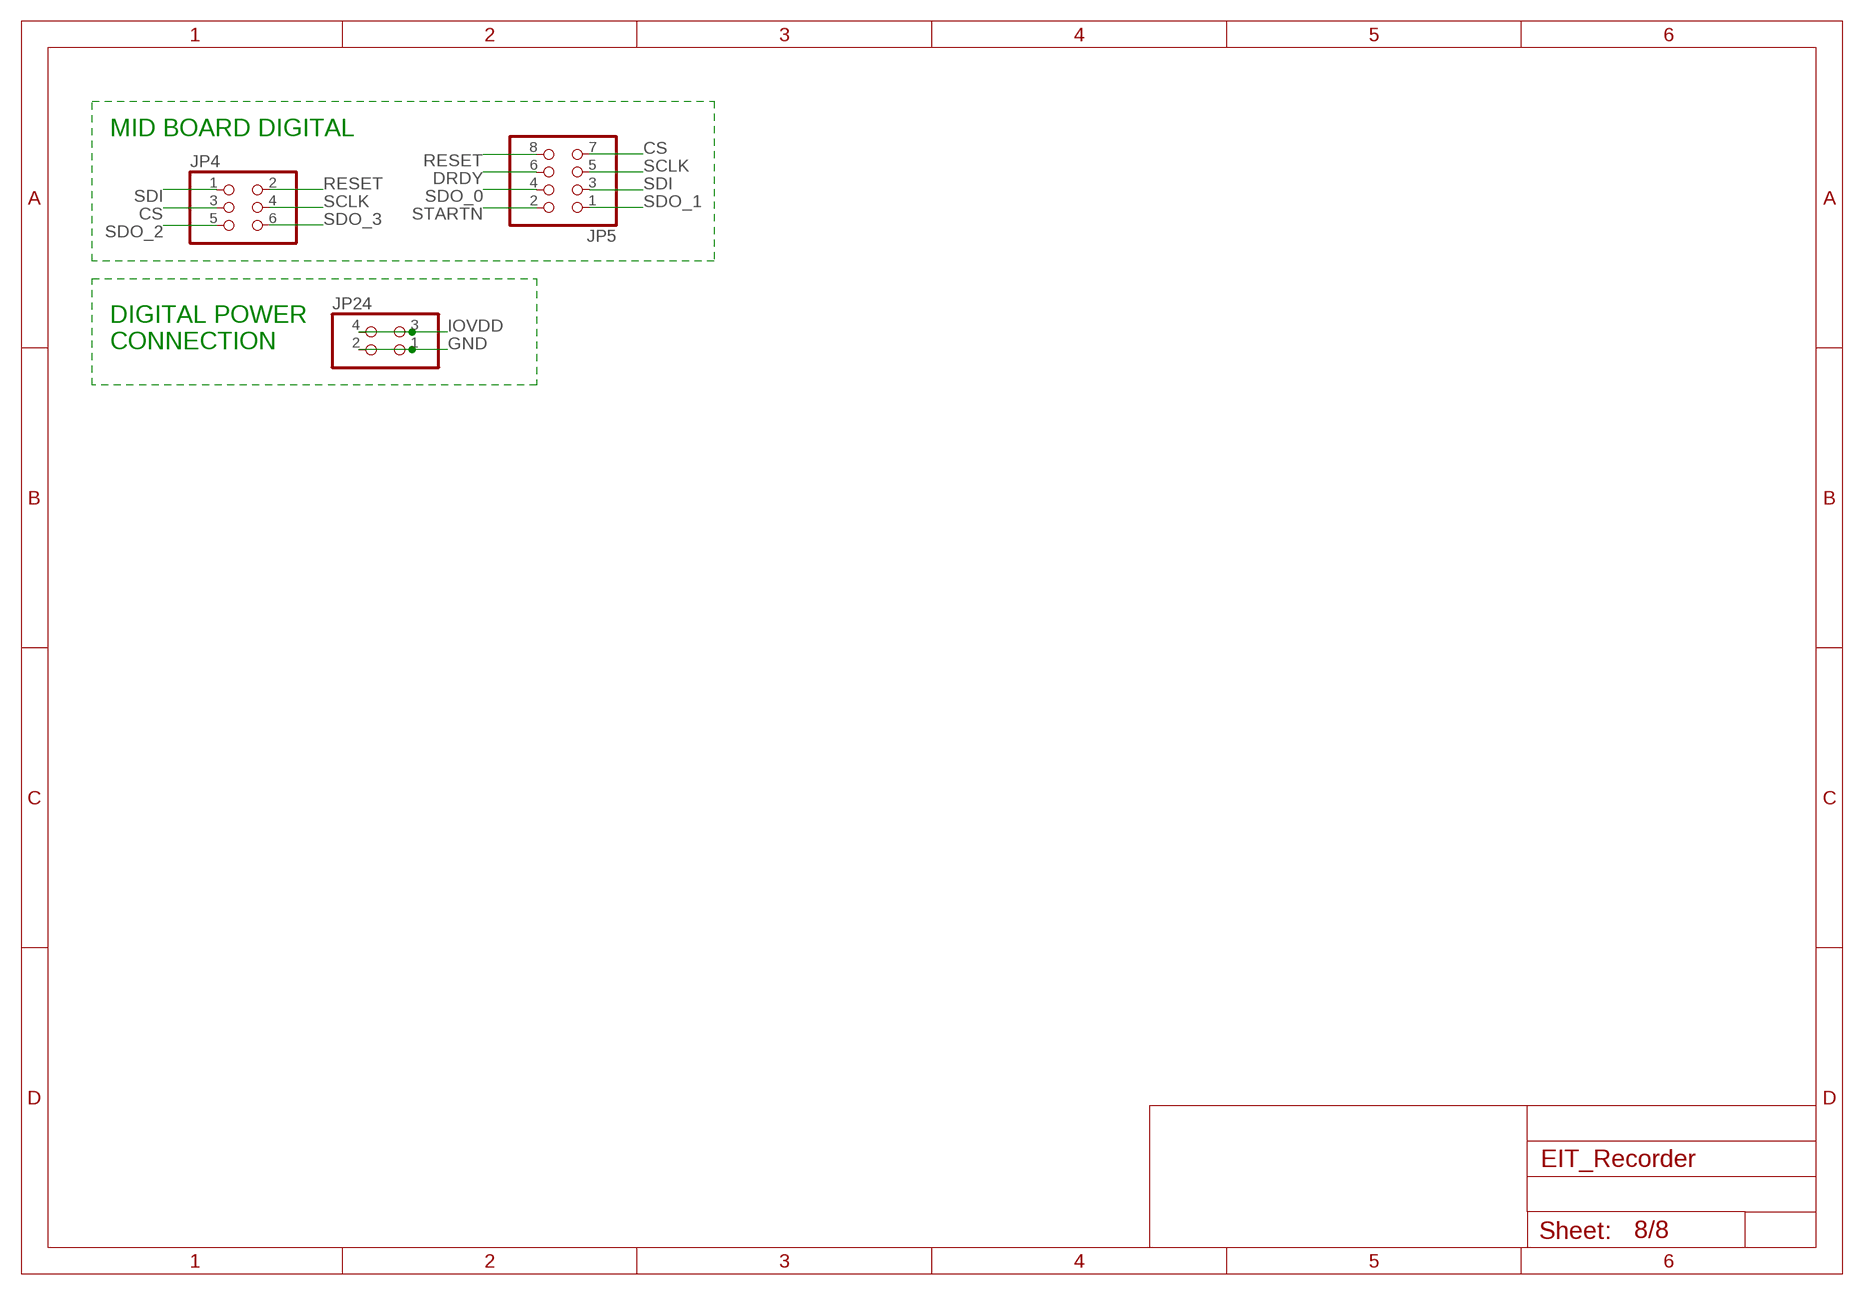
[diagram p7: schematic, sheet 8]

### Parts
JP4  PINHD-2X3  [2X03]
JP5  PINHD-2X4  [2X04]
JP24  PINHD-2X2  [2X02]

### Nets
CS: JP4.3 JP5.7 ; also sheet 1,2,3,4
DRDY: JP5.6 ; also sheet 1
GND: JP24.1 JP24.2 ; also sheet 1,2,3,4,5,6,7
IOVDD: JP24.3 JP24.4 ; also sheet 1,2,3,4,5,6
RESET: JP4.2 JP5.8 ; also sheet 1,2,3,4
SCLK: JP4.4 JP5.5 ; also sheet 1,2,3,4
SDI: JP4.1 JP5.3 ; also sheet 1,2,3,4
SDO_0: JP5.4 ; also sheet 1
SDO_1: JP5.1 ; also sheet 2
SDO_2: JP4.5 ; also sheet 3
SDO_3: JP4.6 ; also sheet 4
STARTN: JP5.2 ; also sheet 2

### Notes on the sheet
- MID BOARD DIGITAL
- DIGITAL POWER 
  CONNECTION

## Library data of the parts
AVDD IOVDD JP_AIN_OUT JP_VCM_OUT VREF = pinhead:PINHD-1X1: PIN HEADER
C1 C2 C24 C25 = EIT_Recorder:C0603
C3 C11 C16 C18 C20-C23 C26-C102 = EIT_Recorder:C0402
C13 C19 = EIT_Recorder:C0805
GND_1 JP_VPOS1 = pinhead:PINHD-1X2: PIN HEADER
JP1-JP3 JP6-JP10 JP24 = pinhead:PINHD-2X2: PIN HEADER
JP4 = pinhead:PINHD-2X3: PIN HEADER
JP5 = pinhead:PINHD-2X4: PIN HEADER
R6 R14 R15 R23 R24 = EIT_Recorder:R0603
U1 U3 = EIT_Recorder:ADP7118ACPZN
U6 = EIT_Recorder:AD441BRZ
U7-U10 = EIT_Recorder:AD7771
Y1 = EIT_Recorder:OSC-ECS-2520MVLC

## Board
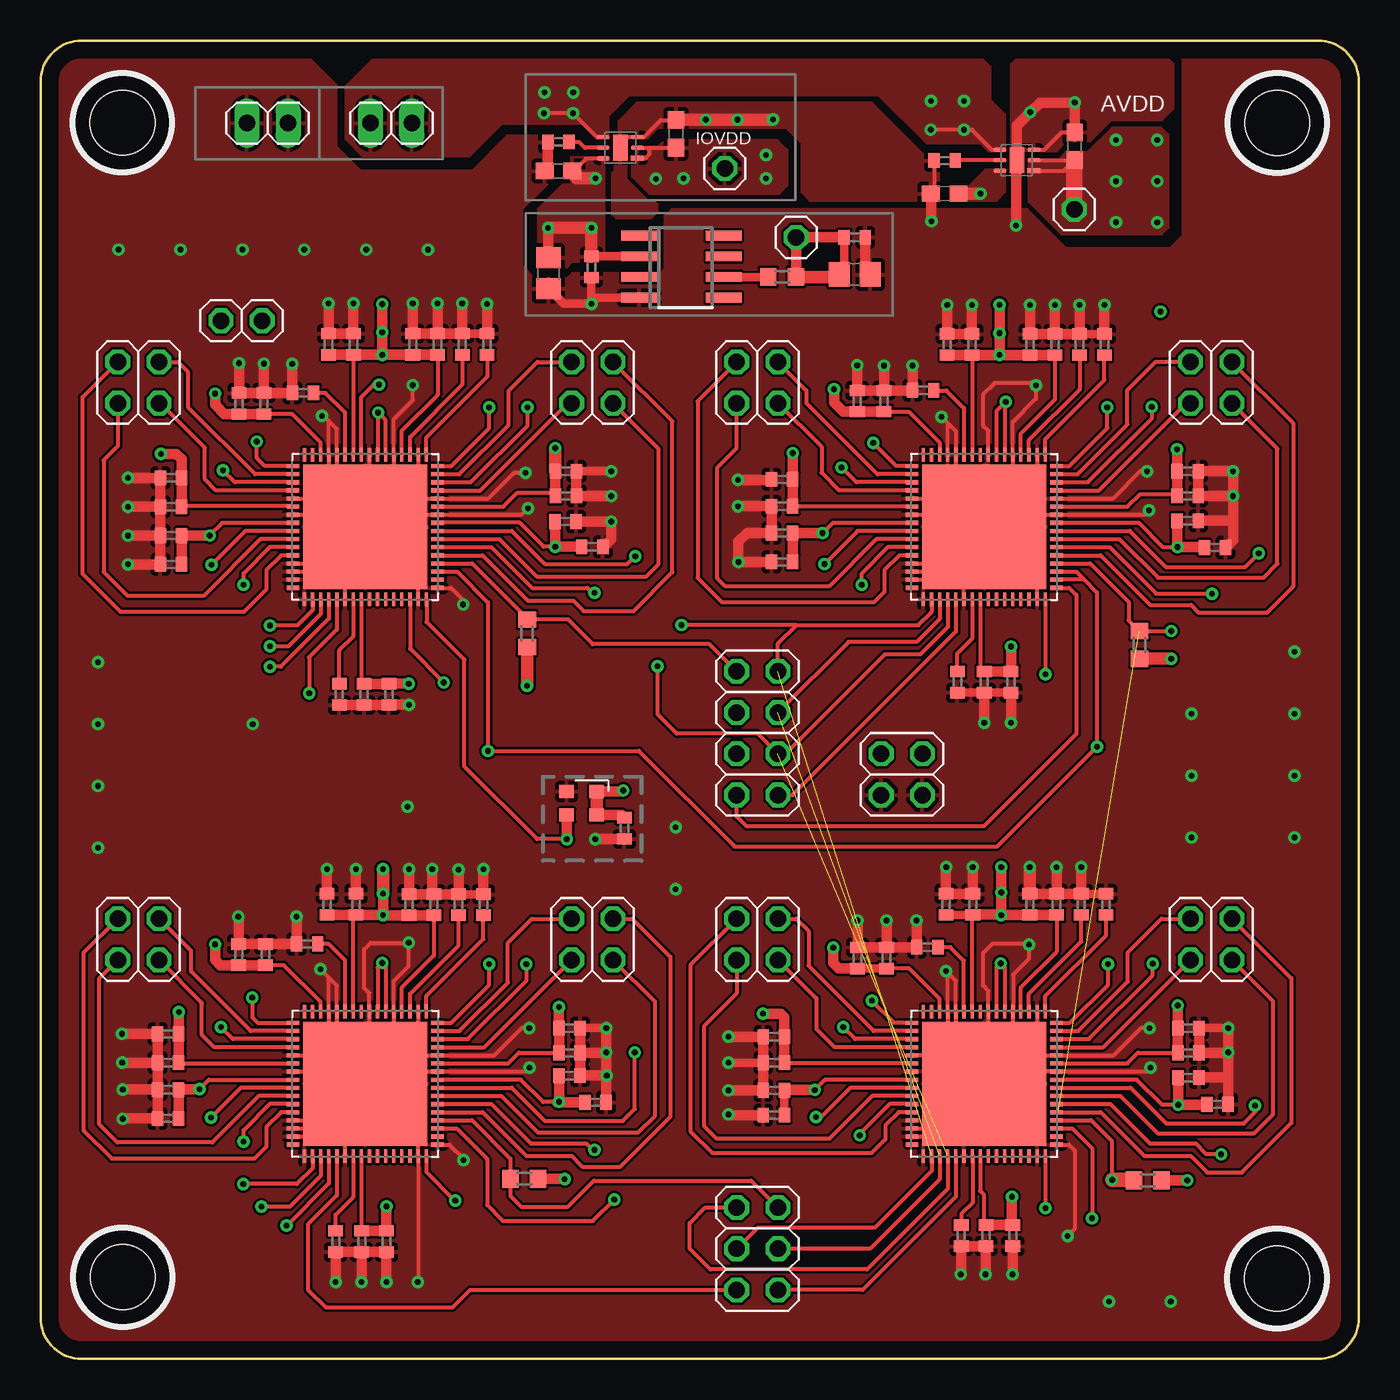
[diagram p8: board, top side]
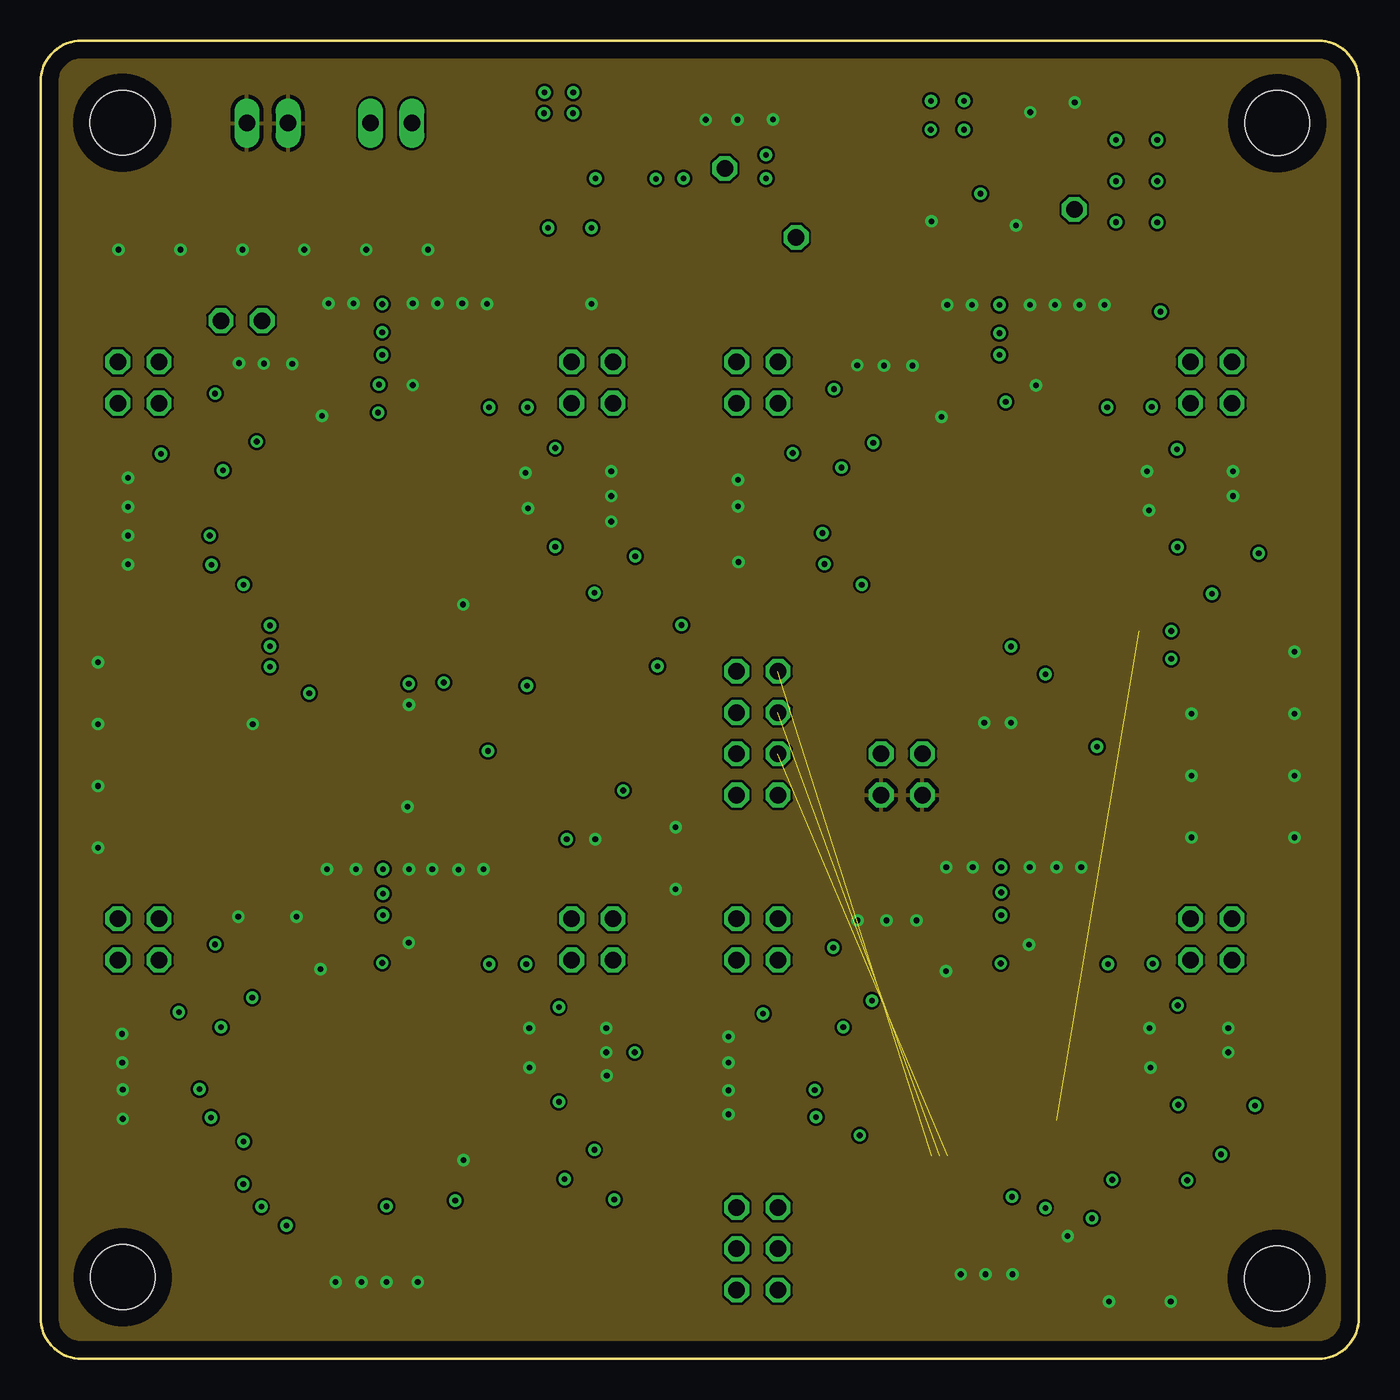
[diagram p9: board, inner layer Route2]
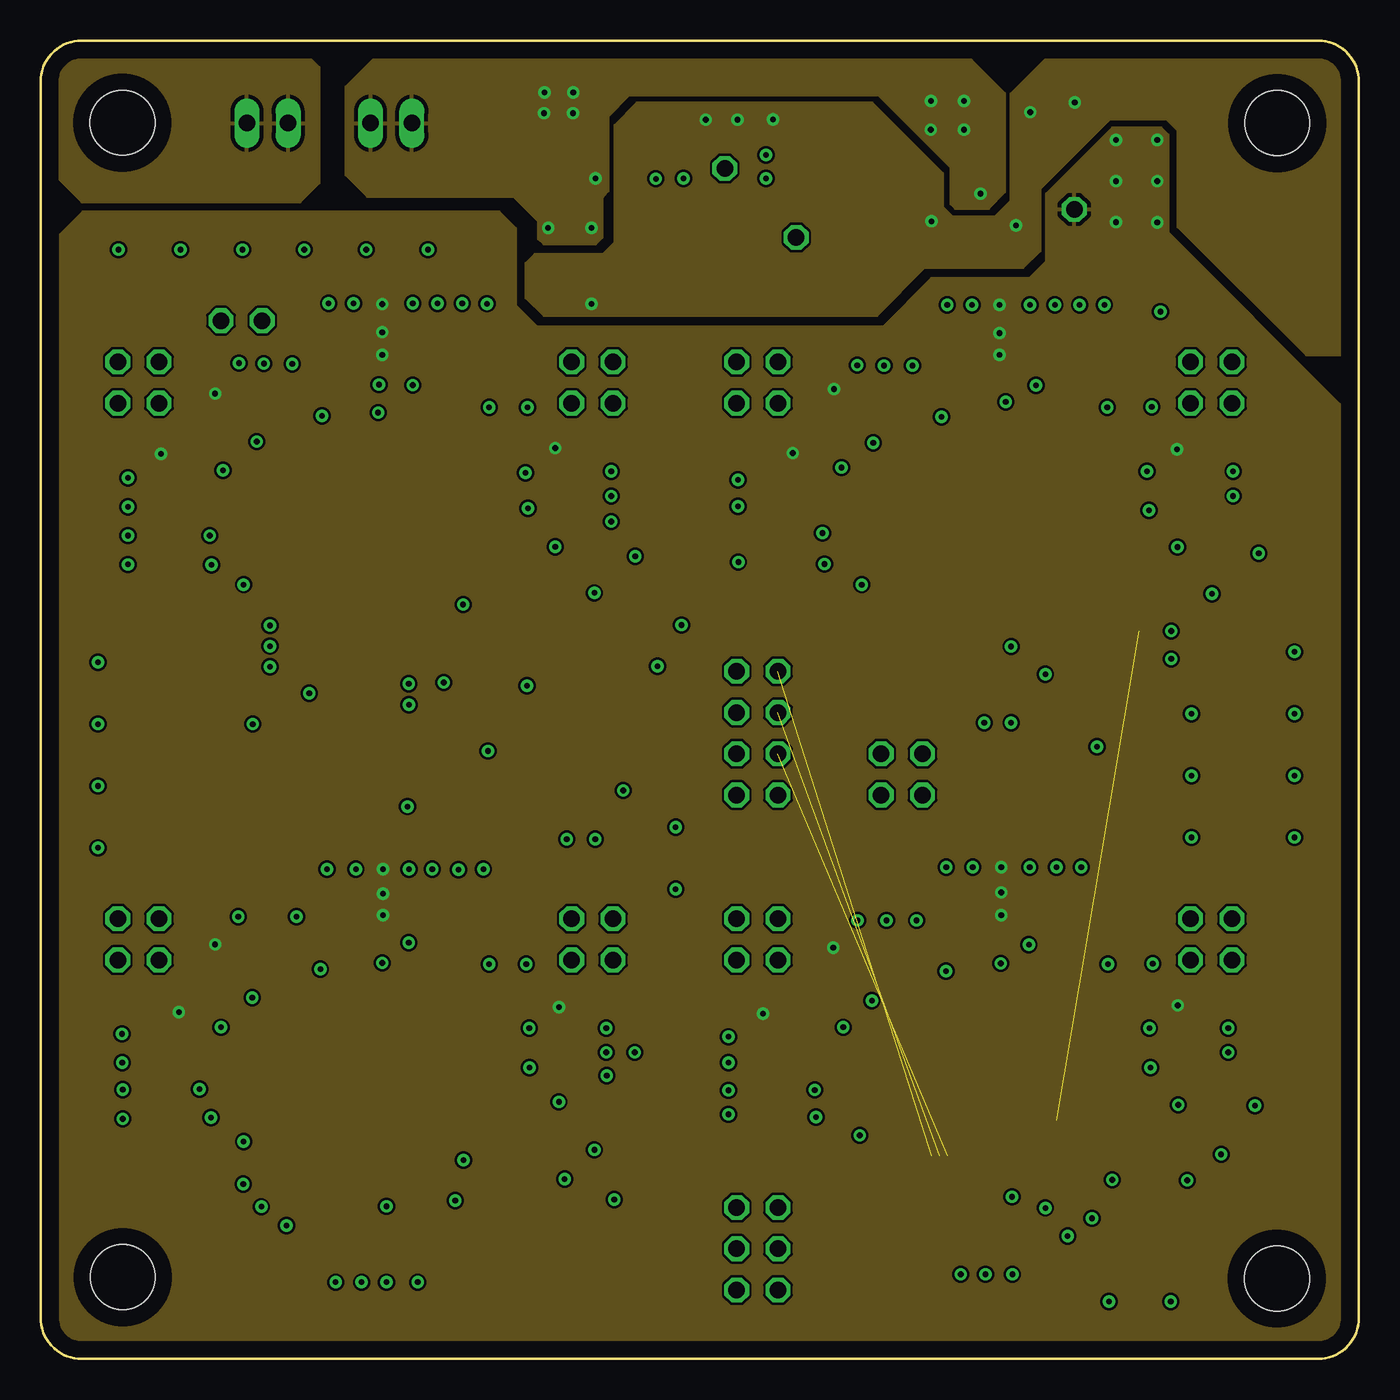
[diagram p10: board, inner layer Route3]
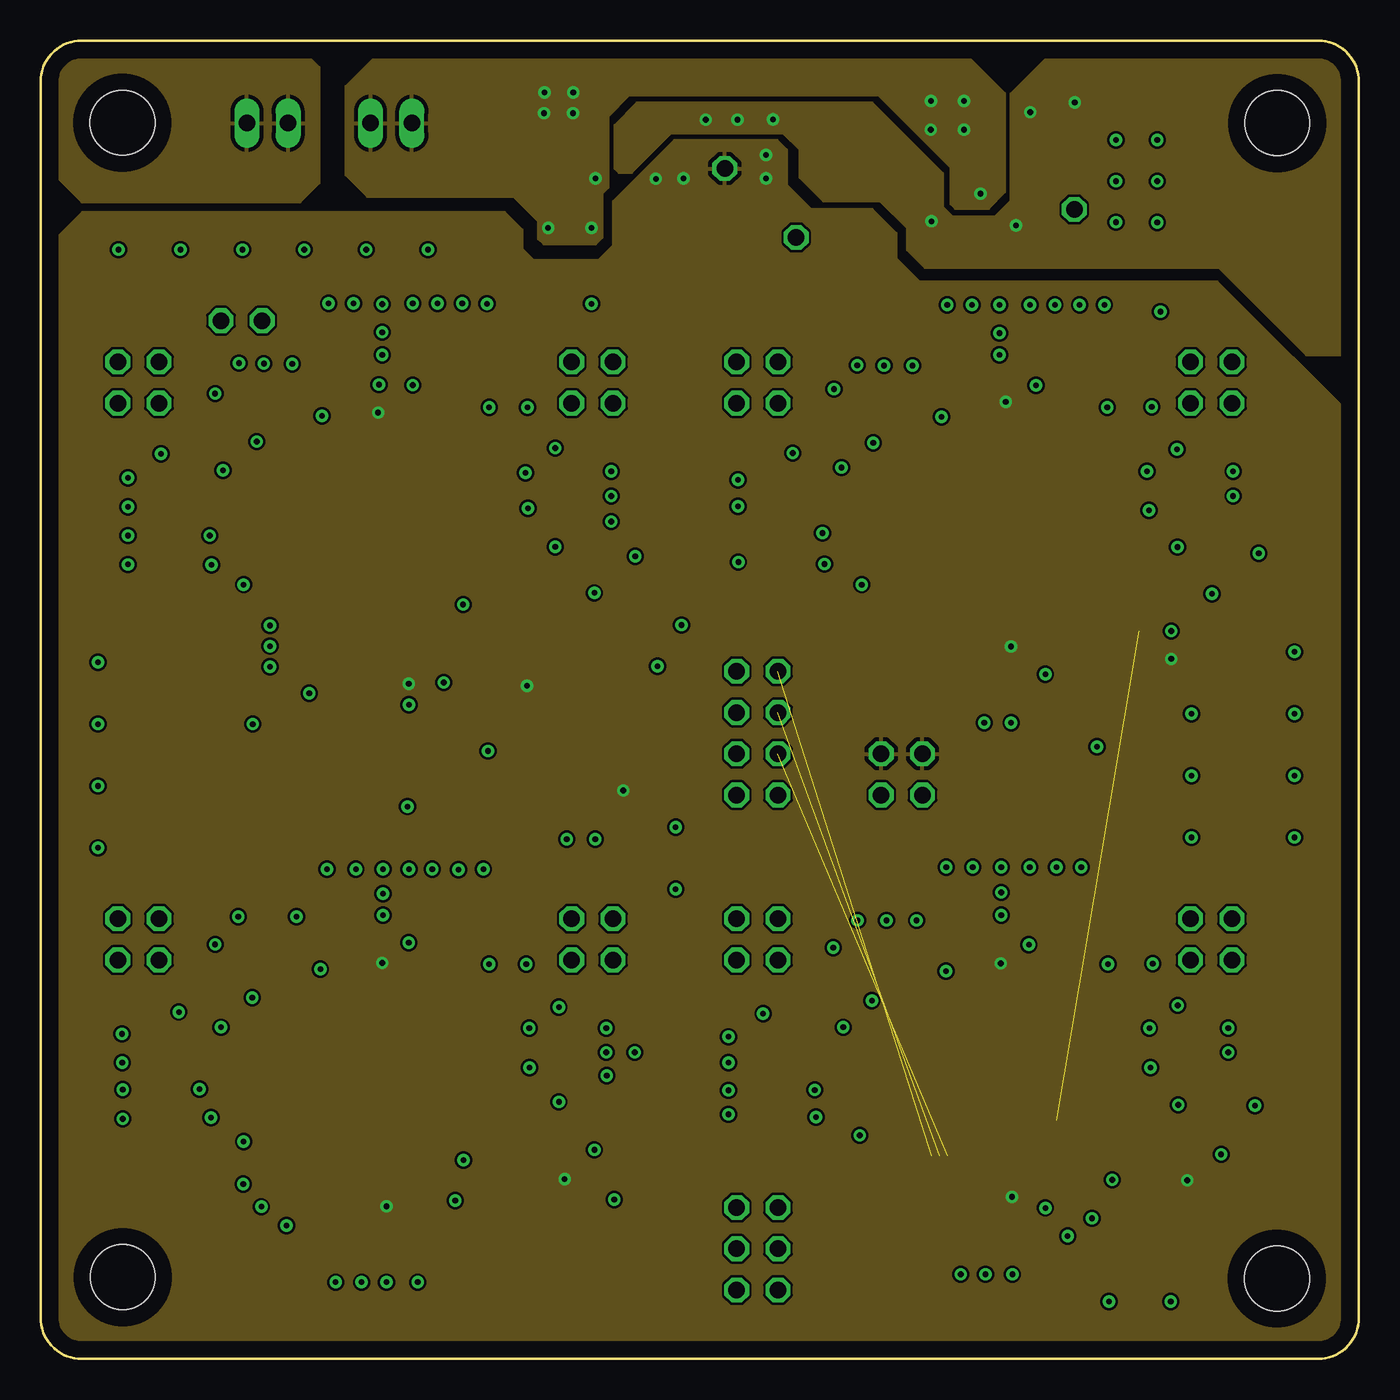
[diagram p11: board, inner layer Route14]
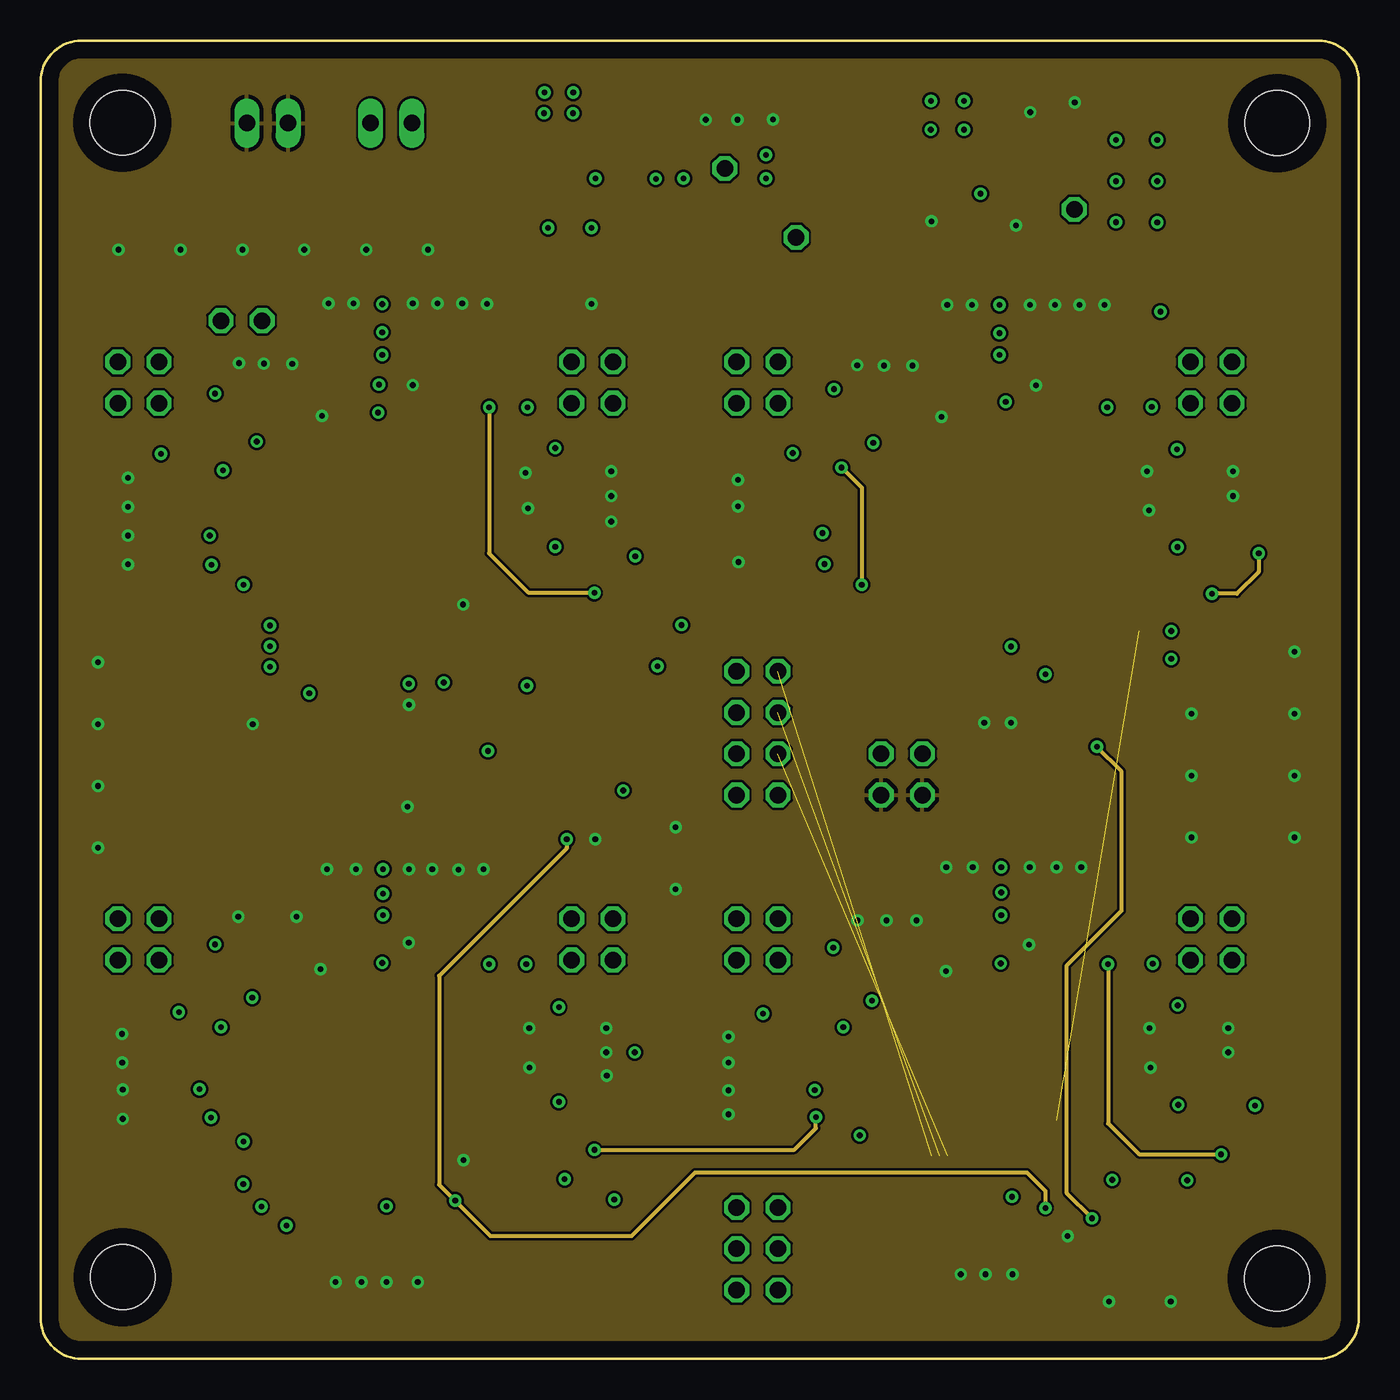
[diagram p12: board, inner layer Route15]
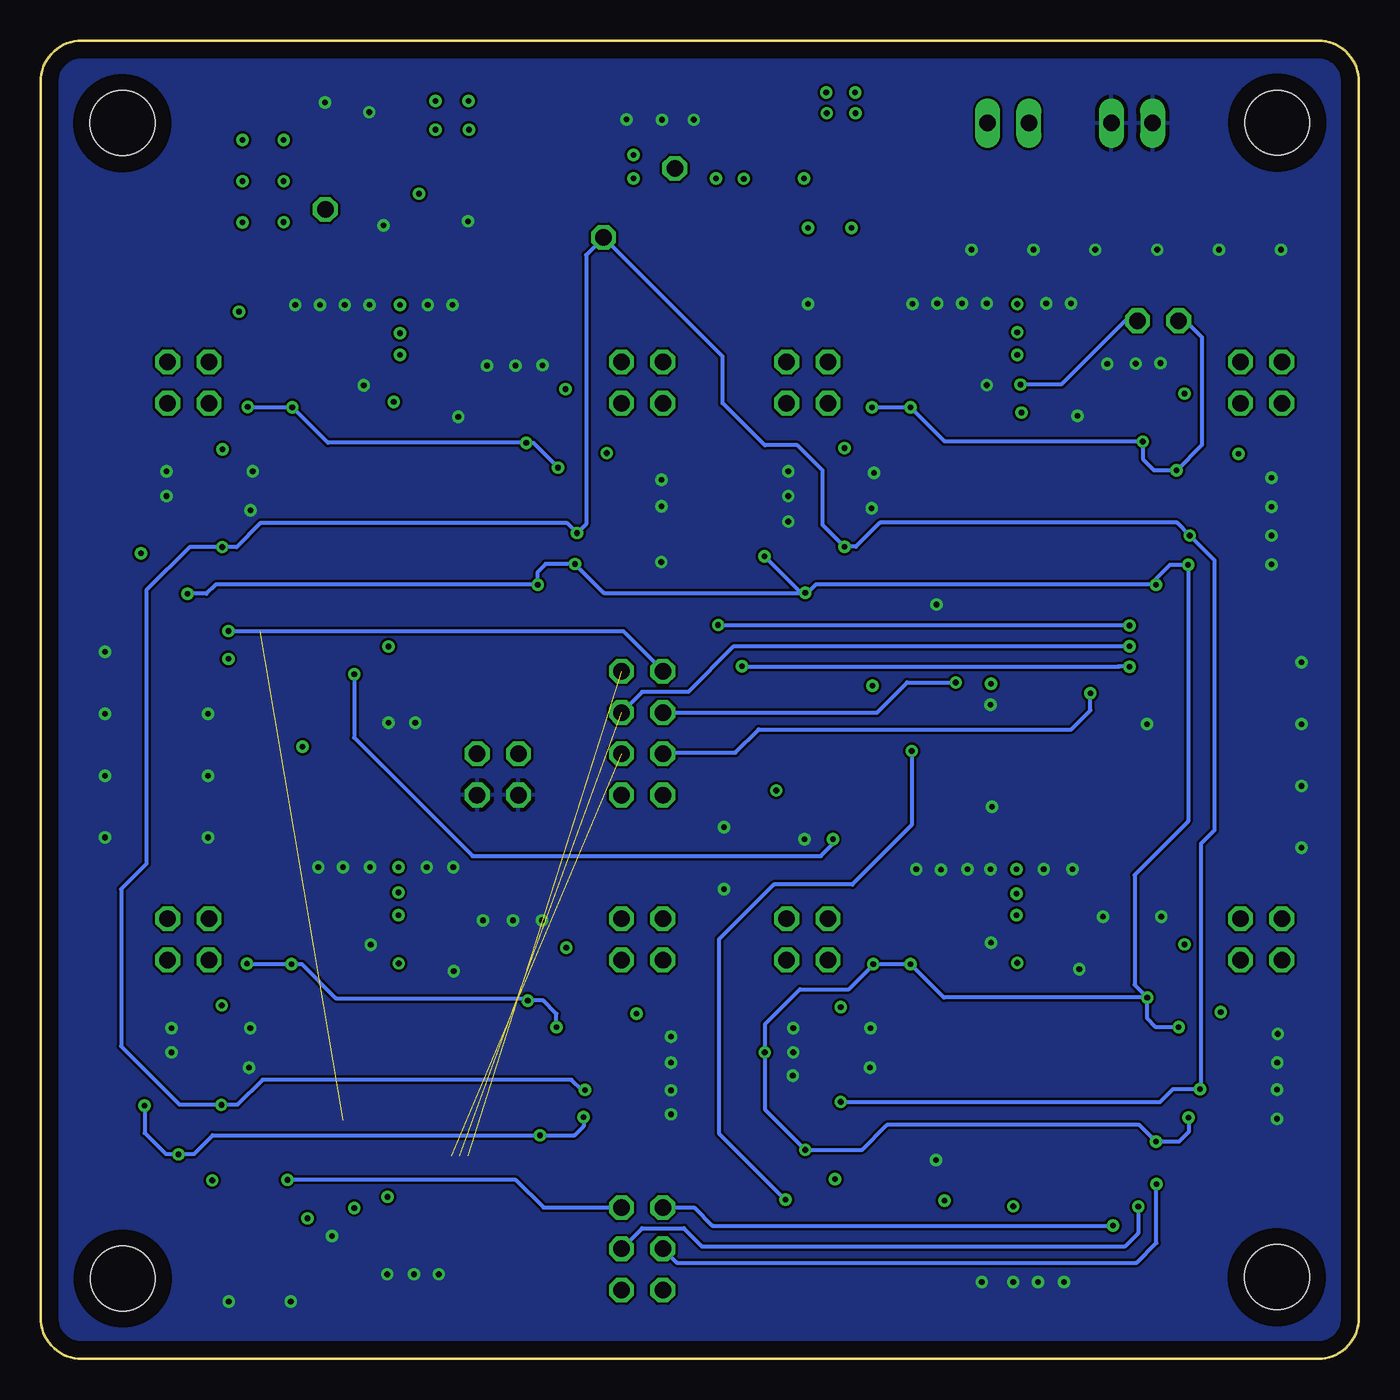
[diagram p13: board, bottom side, seen from below]

Size 81.15 x 81.18 mm. Coordinates in mm from the lower left corner, seen from the top.
Outline: 0,78.64 0,2.54 arc90 2.54,0 78.61,0 arc90 81.15,2.54 81.15,78.64 arc90 78.61,81.18 2.54,81.18 arc90 0,78.64
Copper layers (1+2+3*14+15+16): Top 0.035mm / dielectric 1.5mm / Route2 0.035mm / dielectric 0.15mm / Route3 0.035mm / dielectric 0.2mm / Route14 0.035mm / dielectric 0.15mm / Route15 0.035mm / dielectric 0.2mm / Bottom 0.035mm
Design rules "default *": minimum track width 6mil, minimum drill 0.35mm, track to track 6mil, track to pad 6mil, pad to pad 6mil, via to via 6mil, smd to smd 6mil, copper to edge 40mil, drill to drill 6mil, minimum pad ring 10mil, minimum via ring 8mil, stop-mask expansion 4mil, vias tented up to drill 0mil, thermal gap 10mil
Holes 3.99 mm at 76.12,76.1 5.03,76.12 76.1,4.95 5.05,5.03

### Footprints (pad centres in the part's own frame; a part is rotated, then mirrored left to right if it is on the bottom)
1X01 = drill 1.016 octagon: 1 0,0
C0603 = smd 1.1 x 1: 1 -0.85,0; 2 0.85,0
C0402 = smd 0.7 x 0.9: 1 -0.65,0; 2 0.65,0
C0805 = smd 1.3 x 1.5: 1 -0.95,0; 2 0.95,0
1X02 = drill 1.016 long: 1 -1.27,0; 2 1.27,0
2X02 = drill 1.016 octagon: 1 -1.27,-1.27; 2 -1.27,1.27; 3 1.27,-1.27; 4 1.27,1.27
2X03 = drill 1.016 octagon: 1 -2.54,-1.27; 2 -2.54,1.27; 3 0,-1.27; 4 0,1.27; 5 2.54,-1.27; 6 2.54,1.27
2X04 = drill 1.016 octagon: 1 -3.81,-1.27; 2 -3.81,1.27; 3 -1.27,-1.27; 4 -1.27,1.27; 5 1.27,-1.27; 6 1.27,1.27; 7 3.81,-1.27; 8 3.81,1.27
R0603 = smd 1 x 1.1: 1 -0.85,0; 2 0.85,0
LFCSP6_CUSTOM = smd 0.8 x 0.3: 1 -1.05,0.75; 2 -1.05,0.1; 3 -1.05,-0.55; 4 1.05,-0.55; 5 1.05,0.1; 6 1.05,0.75 | smd 0.9 x 1.6: EP 0,0.1
SOIC8N_CUSTOM = smd 0.6 x 2.2: 1 -3.81,-2.6; 2 -2.54,-2.6; 3 -1.27,-2.6; 4 0,-2.6; 5 0,2.6; 6 -1.27,2.6; 7 -2.54,2.6; 8 -3.81,2.6
LFCSP64_CUSTOM = smd 0.84 x 0.26: 1 -4.445,3.75; 2 -4.445,3.25; 3 -4.445,2.75; 4 -4.445,2.25; 5 -4.445,1.75; 6 -4.445,1.25; 7 -4.445,0.75; 8 -4.445,0.25; 9 -4.445,-0.25; 10 -4.445,-0.75; 11 -4.445,-1.25; 12 -4.445,-1.75; 13 -4.445,-2.25; 14 -4.445,-2.75; 15 -4.445,-3.25; 16 -4.445,-3.75; 33 4.445,-3.75; 34 4.445,-3.25; 35 4.445,-2.75; 36 4.445,-2.25; 37 4.445,-1.75; 38 4.445,-1.25; 39 4.445,-0.75; 40 4.445,-0.25; 41 4.445,0.25; 42 4.445,0.75; 43 4.445,1.25; 44 4.445,1.75; 45 4.445,2.25; 46 4.445,2.75; 47 4.445,3.25; 48 4.445,3.75 | smd 0.26 x 0.84: 17 -3.75,-4.445; 18 -3.25,-4.445; 19 -2.75,-4.445; 20 -2.25,-4.445; 21 -1.75,-4.445; 22 -1.25,-4.445; 23 -0.75,-4.445; 24 -0.25,-4.445; 25 0.25,-4.445; 26 0.75,-4.445; 27 1.25,-4.445; 28 1.75,-4.445; 29 2.25,-4.445; 30 2.75,-4.445; 31 3.25,-4.445; 32 3.75,-4.445; 49 3.75,4.445; 50 3.25,4.445; 51 2.75,4.445; 52 2.25,4.445; 53 1.75,4.445; 54 1.25,4.445; 55 0.75,4.445; 56 0.25,4.445; 57 -0.25,4.445; 58 -0.75,4.445; 59 -1.25,4.445; 60 -1.75,4.445; 61 -2.25,4.445; 62 -2.75,4.445; 63 -3.25,4.445; 64 -3.75,4.445 | smd 7.65 x 7.65: 65 0,0
ECS-2520MVLC = smd 0.9 x 0.8: P$1 0.925,0.725; P$2 -0.925,0.725; P$3 -0.925,-0.725; P$4 0.925,-0.725

### Placement (x,y rotation side)
AVDD  63.63,70.79 270 top
C1  31.88,73.15 180 top
C2  39.12,75.44 90 top
C3  31.88,74.93 180 top
C11  7.85,16.59 180 top
C13  31.27,66.85 270 top
C16  33.91,67.23 270 top
C18  50.11,69.06 0 top
C19  50.11,66.78 0 top
C20  7.85,14.81 180 top
C21  32.56,17.45 0 top
C22  34.16,15.8 0 top
C23  7.85,20.02 180 top
C24  63.65,74.68 90 top
C25  55.65,71.75 180 top
C26  35.94,32.66 270 top
C27  8.03,48.92 180 top
C28  8.03,50.7 180 top
C29  33.96,50.01 0 top
C30  32.31,51.56 0 top
C31  13.74,58.83 90 top
C32  12.22,58.83 90 top
C33  8.03,52.48 180 top
C34  8.03,54.25 180 top
C35  32.33,53.14 0 top
C36  32.33,54.66 0 top
C37  19.25,62.48 90 top
C38  18.39,40.92 90 top
C39  19.91,40.92 270 top
C40  21.44,40.92 270 top
C41  17.73,62.48 90 top
C42  25.96,62.48 90 top
C43  16.15,59.49 0 top
C44  24.43,62.48 270 top
C45  22.91,62.48 270 top
C46  27.48,62.48 270 top
C47  45.64,50.85 180 top
C48  45.64,49.07 180 top
C49  70.61,51.61 0 top
C50  72.29,49.96 0 top
C51  45.64,54.15 180 top
C52  45.64,52.5 180 top
C53  70.61,54.66 0 top
C54  70.61,53.14 0 top
C55  55.8,62.46 90 top
C56  57.33,62.46 90 top
C57  56.44,41.68 90 top
C58  58.09,41.68 270 top
C59  59.74,41.68 270 top
C60  51.92,58.98 90 top
C61  50.27,58.98 90 top
C62  54.33,59.64 0 top
C63  63.96,62.46 90 top
C64  60.91,62.46 270 top
C65  62.43,62.46 270 top
C66  65.48,62.46 270 top
C67  55.65,73.79 180 top
C68  7.85,18.24 180 top
C69  32.56,18.85 0 top
C70  32.56,20.37 0 top
C71  13.84,24.89 90 top
C72  12.19,24.89 90 top
C73  18.16,7.24 90 top
C74  19.76,7.24 270 top
C75  21.29,7.24 270 top
C76  17.63,27.99 90 top
C77  19.41,27.99 90 top
C78  16.41,25.55 0 top
C79  25.73,27.97 90 top
C80  24.21,27.97 270 top
C81  22.68,27.97 270 top
C82  27.25,27.97 270 top
C83  45.14,16.54 180 top
C84  45.14,15.01 180 top
C85  70.66,17.32 0 top
C86  72.44,15.67 0 top
C87  45.14,18.24 180 top
C88  45.14,19.84 180 top
C89  70.66,20.37 0 top
C90  70.66,18.85 0 top
C91  52.07,24.69 90 top
C92  50.29,24.69 90 top
C93  56.67,7.59 90 top
C94  58.19,7.59 270 top
C95  59.84,7.59 270 top
C96  55.73,27.99 90 top
C97  57.38,27.99 90 top
C98  54.58,25.35 0 top
C99  64.06,27.99 90 top
C100  62.53,27.99 270 top
C101  60.88,27.99 270 top
C102  65.58,27.99 270 top
GND_1  13.97,76.1 180 top
IOVDD  42.11,73.3 270 top
JP1  72.06,25.83 180 top
JP2  33.96,60.12 180 top
JP3  72.06,60.12 0 top
JP4  44.12,6.78 270 top
JP5  44.12,38.53 90 top
JP6  44.12,60.12 180 top
JP7  6.02,60.12 180 top
JP8  44.12,25.83 180 top
JP9  33.96,25.83 180 top
JP10  6.02,25.83 180 top
JP24  53.01,35.99 90 top
JP_AIN_OUT  11.1,63.93 0 top
JP_VCM_OUT  13.64,63.93 0 top
JP_VPOS1  21.59,76.1 0 top
R6  29.77,11.1 0 top
R14  68.15,11 0 top
R15  45.64,66.62 0 top
R23  29.95,44.68 270 top
R24  67.64,43.97 270 top
U1  35.69,74.68 180 top
U3  60.1,73.91 180 top
U6  39.45,65.35 270 top
U7  19.99,16.94 0 top
U8  19.99,51.23 0 top
U9  58.09,51.23 0 top
U10  58.09,16.94 0 top
VREF  46.51,69.06 180 top
Y1  33.3,34.21 0 top

### Tracks (layer width: path | path; a pad name or v marks a point on that pad's centre or on a via)
AIN0+
  Top 0.254: U8.2 13.21,54.48 9.07,58.62 9.07,60.78 8.46,61.39 JP7.1
AIN1+
  Top 0.254: U8.4 10.79,53.48 10.11,54.17 10.11,56.11 7.37,58.85 JP7.2
AIN2+
  Top 0.254: U8.10 13.52,50.48 10.03,46.99 5.36,46.99 3.89,48.46 3.89,55.35 4.75,56.21 JP7.4
AIN3+
  Top 0.254: U8.12 14.81,49.48 13.89,48.56 13.89,47.38 12.52,46.01 4.92,46.01 2.59,48.34 2.59,59.23 JP7.3
AIN4+
  Top 0.254: U8.47 25.78,54.48 28.8,57.51 28.8,59.61 30.58,61.39 JP2.3
AIN5+
  Top 0.254: U8.45 27.07,53.48 32.44,58.85 JP2.4
AIN6+
  Top 0.254: U8.39 28.23,50.48 30.53,48.18 37.29,48.18 38.05,48.95 38.05,56.03 JP2.2
AIN7+
  Top 0.254: U8.37 27.2,49.48 30,46.69 32.79,46.69 33.43,46.05 36.5,46.05 38.89,48.44 38.89,57.73 JP2.1
AIN8+
  Top 0.254: U9.2 51.51,54.48 47.14,58.85 47.14,59.64 JP6.1
AIN9+
  Top 0.254: U9.4 49.16,53.48 48.07,54.57 48.07,56.17 JP6.2
AIN10+
  Top 0.254: U9.10 51.45,50.48 48.56,47.6 42.11,47.6 41.66,48.06 41.66,54.89 42.85,56.08 JP6.4
AIN11+
  Top 0.254: U9.12 52.86,49.48 51.94,48.56 51.94,47.23 51.31,46.6 41.94,46.6 40.44,48.09 40.44,58.98 JP6.3
AIN12+
  Top 0.254: U9.47 63.83,54.48 66.89,57.54 66.89,59.66 68.62,61.39 JP3.2
AIN13+
  Top 0.254: U9.45 65.14,53.48 70.51,58.85 JP3.1
AIN14+
  Top 0.254: U9.39 66.41,50.48 68.78,48.11 75.28,48.11 76.13,48.96 76.13,56.05 JP3.3
AIN15+
  Top 0.254: U9.37 65.25,49.48 68.3,46.43 70.82,46.43 71.27,45.97 75.51,45.97 77.11,47.57 77.11,57.61 JP3.4
AIN16+
  Top 0.254: U7.2 12.93,20.19 9.27,23.85 9.27,25.12 JP10.1
AIN17+
  Top 0.254: U7.4 10.69,19.19 9.93,19.95 9.93,21.92 JP10.2
AIN18+
  Top 0.254: U7.10 13.42,16.19 10.57,13.33 4.72,13.33 3.62,14.44 3.62,23.43 JP10.4
AIN19+
  Top 0.254: U7.12 14.81,15.19 13.89,14.27 13.89,13.07 13.17,12.34 4.37,12.34 2.67,14.05 2.67,25.02 JP10.3
AIN20+
  Top 0.254: U7.47 25.78,20.19 28.76,23.17 28.76,25.62 30.24,27.1 JP9.3
AIN21+
  Top 0.254: U7.45 27.32,19.19 JP9.4
AIN22+
  Top 0.254: U7.39 28.36,16.19 30.61,13.94 36.78,13.94 37.82,14.98 37.82,21.97 JP9.2
AIN23+
  Top 0.254: U7.37 27.2,15.19 29.9,12.5 32.69,12.5 33.35,11.84 35.69,11.84 38.76,14.91 38.76,24.76 36.42,27.1 JP9.1
AIN24+
  Top 0.254: U10.2 51.28,20.19 47.27,24.21 47.27,26.34 46.51,27.1 JP8.1
AIN25+
  Top 0.254: U10.4 48.87,19.19 47.75,20.31 47.75,22.2 JP8.2
AIN26+
  Top 0.254: U10.10 51.19,16.19 48.55,13.55 41.62,13.55 40.86,14.31 40.86,20.51 42.85,22.5 JP8.4
AIN27+
  Top 0.254: U10.12 52.81,15.19 51.99,14.38 51.99,13.51 51.14,12.66 41.36,12.66 40.03,14 40.03,24.28 JP8.3
AIN28+
  Top 0.254: U10.47 63.88,20.19 66.93,23.24 66.93,25.04 68.99,27.1 JP1.3
AIN29+
  Top 0.254: U10.45 65.42,19.19 JP1.4
AIN30+
  Top 0.254: U10.39 66.46,16.19 68.76,13.89 74.7,13.89 75.87,15.06 75.87,22.02 JP1.2
AIN31+
  Top 0.254: U10.37 65.25,15.19 67.94,12.5 70.79,12.5 71.81,11.48 73.94,11.48 76.99,14.53 76.99,23.44 JP1.1
AIN-  (via drill 0.35)
  Top 0.254: U8.1 13.8,54.98 13.31,55.47 v13.31,56.49 | U8.3 11.96,53.98 v11.23,54.71 | v10.52,48.89 12.6,50.98 U8.9 | U8.11 14.11,49.98 12.5,48.37 v12.5,47.68 | U8.48 25.26,54.98 27.61,57.33 v27.61,58.6 | U8.46 26.47,53.98 29.97,57.48 v29.97,58.6 | U8.38 27.75,49.98 30.26,47.47 33.65,47.47 34.09,47.04 v34.09,47.17 | U8.40 29,50.98 31.04,48.95 36.12,48.95 v36.6,49.43 | U9.1 52.65,54.98 51.26,56.38 v51.26,56.41 | U9.3 50.21,53.98 v49.3,54.89 | v48.26,48.95 50.3,50.98 U9.9 | U9.11 52.16,49.98 50.55,48.37 v50.55,47.68 | U9.48 63.31,54.98 65.66,57.33 v65.66,58.6 | U9.46 64.47,53.98 68.39,57.9 68.39,58.61 v68.4,58.62 | U9.38 65.8,49.98 68.66,47.12 v72.11,47.12 | U9.40 67.05,50.98 69.27,48.77 74.14,48.77 v74.98,49.61 | U7.1 13.36,20.69 13.03,21.02 v13.03,22.25 | U7.3 11.83,19.69 v11.1,20.42 | v10.49,14.86 12.32,16.69 U7.9 | U7.11 14.11,15.69 12.5,14.08 v12.5,13.39 | U7.48 25.26,20.69 27.61,23.04 v27.61,24.31 | U7.46 26.3,19.69 29.9,23.29 v29.9,24.31 | U7.38 27.75,15.69 30.18,13.26 33.58,13.26 34.09,12.75 v34.09,12.88 | U7.40 29,16.69 31.04,14.66 35.84,14.66 36.58,15.39 v36.58,18.87 | U10.1 52.54,20.69 v51.17,22.06 | U10.3 50.13,19.69 v49.4,20.42 | v47.73,14.88 48.03,14.88 49.84,16.69 U10.9 | U10.11 52.26,15.69 50.42,13.85 v50.42,13.77 | U10.48 63.36,20.69 65.71,23.04 v65.71,24.31 | U10.46 64.52,19.69 68.45,23.62 v68.45,24.33 | U10.38 65.85,15.69 68.28,13.26 71.09,13.26 71.75,12.6 v72.67,12.6 | U10.40 67.1,16.69 69.29,14.5 74.07,14.5 74.75,15.19 v74.75,15.6
  Route15 0.254: v34.09,12.88 46.41,12.88 47.73,14.2 v47.73,14.88 | v34.09,47.17 30.05,47.17 27.61,49.61 v27.61,58.6 | v49.3,54.89 50.55,53.64 v50.55,47.68 | v65.71,24.31 65.71,14.5 67.61,12.6 v72.67,12.6 | v74.98,49.61 74.98,48.46 73.63,47.12 v72.11,47.12
  Bottom 0.254: v29.97,58.6 v27.61,58.6 25.5,56.49 v13.31,56.49 13.31,55.42 12.6,54.71 v11.23,54.71 9.65,56.29 9.65,62.89 10.69,63.93 JP_AIN_OUT.1 | v36.6,49.43 34.34,47.17 v34.09,47.17 | v68.4,58.62 65.68,58.62 v65.66,58.6 63.47,56.41 v51.26,56.41 50.83,56.41 v49.3,54.89 | v72.11,47.12 70.94,47.12 70.38,47.68 v50.55,47.68 50.55,48.46 50.06,48.95 v48.26,48.95 46.48,47.17 v34.09,47.17 | v10.49,14.86 10.49,13.97 11.07,13.39 v12.5,13.39 13.51,14.4 29.06,14.4 30.58,12.88 v34.09,12.88 36.58,15.37 v36.58,18.87 36.58,20.6 34.42,22.76 31.39,22.76 29.9,24.26 v29.9,24.31 v27.61,24.31 25.55,22.25 v13.03,22.25 | v47.73,14.88 47.73,14.33 48.29,13.77 v50.42,13.77 70.56,13.77 71.73,12.6 v72.67,12.6 73.43,12.6 74.75,13.92 v74.75,15.6 | v68.45,24.33 65.74,24.33 v65.71,24.31 65.07,24.31 62.98,22.21 51.32,22.21 v51.17,22.06 51.16,22.07 50.22,22.07 49.4,21.26 v49.4,20.42 | v34.09,47.17 33.96,47.17 33.45,47.68 v12.5,47.68 12.5,48.03 11.63,48.89 v10.52,48.89 10.52,33.1 13.82,29.79 13.82,23.04 v13.03,22.25 | v11.1,20.42 12.5,20.42 13.03,20.95 v13.03,22.25
AVDD  (via drill 0.35)
  Top 0.254: C31.1 15.48,58.18 17.24,56.42 U8.62 | U8.52 22.24,57.16 24.43,59.36 C44.2 | C37.1 19.24,61.82 U8.58 | U8.43 28.48,52.48 29.31,53.31 31.51,53.31 C35.1 | U8.6 15.52,52.51 8.71,52.51 C33.1 | U3.2 61.16,73.8 63.63,73.8 C24.1 62.99,73.16 U3.1 | U9.52 60.34,56.99 62.43,59.08 C65.2 | C56.1 57.33,61.76 57.34,61.75 U9.58 | U9.43 66.9,52.48 67.66,53.24 69.86,53.24 C54.1 | C52.1 46.31,52.48 U9.6 | C71.1 14.98,24.24 17.24,21.98 U7.62 | U7.52 22.24,22.87 24.21,24.84 C80.2 | U10.62 55.34,22.16 53.46,24.04 C91.1 | U10.52 60.34,22.87 62.53,25.07 C100.2 C101.2 | U10.58 57.34,27.28 57.39,27.33 57.41,27.36 | C90.1 67.55,18.85 66.89,18.19 U10.43 | U10.6 45.84,18.19 C87.1 | U7.58 19.24,27.17 C77.1 | U7.6 15.52,18.17 8.57,18.17 C68.1 | U7.43 28.78,18.19 29.44,18.85 C69.1 | C60.1 53.43,58.33 55.34,56.42 U9.62
  Top 0.508: C96.1 C97.1 | C92.1 C91.1
  Top 0.635: C31.1 C32.1 11.32,58.18 10.74,58.75 v10.74,59.44 | C44.2 C45.2 21.02,61.83 | C36.1 C35.1 | C54.1 C53.1 v69.96,56 v69.95,56.01 | C41.1 C37.1 21.02,61.83 | C55.1 C56.1 59.01,61.81 | C65.2 C64.2 59.01,61.81 | v10.74,25.53 10.74,24.56 11.06,24.24 C72.1 C71.1 | C90.1 C89.1 v70.01,21.76 v70,21.77 | C100.2 59.13,27.34 v59.13,27.33 | C92.1 49.14,24.04 48.79,24.38 v48.79,25.32 | v44.48,21.26 45.57,21.26 45.79,21.04 C88.1 C87.1 | 22.62,27.33 22.63,27.32 C80.2 C81.2 v21.1,27.32 v21.08,27.33 v21.08,28.65 | v8.51,21.36 8.5,21.35 C23.1 C68.1 | 59.01,61.81 v59.03,61.82 v59.03,63.17 v59.03,64.9 | C60.1 C61.1 49.39,58.33 48.84,58.88 v48.84,59.72 | 46.31,52.48 46.31,54.13 C51.1 46.29,55.77 v46.3,55.78 | 21.02,61.83 v21.03,61.82 v21.03,63.22 v21.03,64.95 | v7.42,55.73 8.36,55.73 8.68,55.41 C34.1 C33.1 | v59.13,27.33 v59.13,28.73 v59.13,30.28 | v59.13,27.33 59.11,27.36 57.41,27.36 | 57.39,27.33 C97.1 | C69.1 C70.1 31.9,20.38 v31.9,21.67 | C76.1 C77.1 | C77.1 19.42,27.33 | C77.1 21.07,27.34
  Top 0.762: 21.07,27.34 v21.08,27.33 | C36.1 31.68,56.07 v31.67,56.08 | v21.08,28.65 v21.08,30.15
  Top 1.016: C24.1 63.61,73.79 63.61,70.8 AVDD.1
  other vias: 68.73,75.06 68.73,72.52 66.19,72.52 66.19,70 68.73,69.98 66.19,75.06
  pour Top (no thermals): 69.01,69.27 69.42,69.67 69.42,75.39 68.99,75.82 65.96,75.82 64.44,74.3 63.09,74.3 62.69,73.89 60.83,73.89 60.83,71.25 62.81,69.27
  pour Route3: 2.59,70.64 1.17,69.22 1.17,0.84 79.98,0.84 79.98,58.8 69.42,69.37 69.42,75.39 68.99,75.82 65.96,75.82 61.9,71.75 61.9,67.59 60.86,66.55 54.84,66.55 51.87,63.58 30.58,63.58 29.26,64.9 29.26,69.62 28.24,70.64
CS  (via drill 0.35)  (1 unrouted)
  Top 0.254: U8.18 16.74,46.1 15.8,45.16 v14.12,45.16 | U7.18 16.74,11.74 15.77,10.77 v12.47,10.77 | U10.18 54.84,11.58 51.33,8.08 44.15,8.08 JP4.3 | U9.18 54.84,46 54.03,45.19 46.53,45.19 | 46.53,45.19 v39.45,45.19 | 46.53,45.19 45.39,44.04 JP5.7
  Bottom 0.254: v12.47,10.77 12.47,7.14 13.69,5.92 41.99,5.92 JP4.3 | v39.45,45.19 14.15,45.19 v14.12,45.16
DRDY  (via drill 0.35)
  Top 0.254: v24.82,41.66 22.74,43.73 U8.30
  Bottom 0.254: JP5.6 29.67,39.8 27.81,41.66 v24.82,41.66
GND  (via drill 0.35)
  Top 0.254: C2.2 38.19,76.29 37.13,75.23 U1.3 35.6,75.23 35.56,75.18 35.56,74.7 U1.EP | 21.74,52.98 23.24,54.48 U8.50 | 20.74,51.98 21.74,52.98 | 21.74,52.98 U8.44 27.56,52.98 29.13,54.56 v29.84,54.56 | 20.24,51.49 20.74,51.98 | 20.74,51.98 U8.42 29.6,51.98 v30,52.37 | 19.99,51.74 19.75,51.98 19.35,51.98 | 19.99,51.74 20.24,51.49 | 21.74,52.98 U8.53 21.74,57.88 22.91,59.05 v22.91,59.97 | 20.24,51.49 U8.65 | 19.86,51.36 U8.65 | U8.13 17.23,48.98 19.55,51.3 | 19.55,51.3 19.99,51.74 | U8.14 17.24,48.48 U8.65 | C67.2 55,71.95 C25.2 | U3.3 61.79,74.46 62.85,75.53 C24.2 | U8.56 20.24,52.37 | 20.24,52.37 20.24,51.74 19.86,51.36 | U8.31 23.24,48.26 23.29,48.31 20.31,51.3 19.55,51.3 | U9.65 58.84,51.98 U9.42 67.96,51.98 v68.22,52.25 | U9.44 66.01,52.98 67.69,54.66 v68.1,54.66 | U9.5 56.34,52.98 57.15,52.17 | 57.15,52.17 57.61,51.71 | 57.61,51.71 U9.65 | U9.7 56.26,51.98 | 56.26,51.98 56.53,51.98 57.78,50.72 56.84,49.78 U9.22 | U9.13 55.28,48.98 57.59,51.3 58.36,51.3 61.34,48.31 U9.31 | U9.14 55.34,48.48 U9.65 | U9.15 54.84,47.98 U9.65 | 56.26,51.98 56.34,52.06 U9.60 56.34,57.12 v55.45,58.01 55.84,57.62 U9.61 | 21.74,18.69 23.24,20.19 U7.50 | 20.74,17.69 21.74,18.69 | 21.74,18.69 U7.44 27.94,18.69 29.62,20.37 v30.07,20.37 | 20.24,17.2 20.74,17.69 | 20.74,17.69 U7.42 29.86,17.69 v30.1,17.93 | 20.24,17.2 19.99,17.45 19.55,17.01 | 21.74,18.69 U7.53 21.74,23.29 22.66,24.21 v22.66,25.63 20.32,25.63 19.91,25.22 19.91,22.83 20.24,22.51 U7.56 20.24,17.45 19.86,17.07 U7.65 | 20.24,17.2 U7.65 | U7.7 17.96,17.69 | 17.96,17.69 18.21,17.69 | 18.21,17.69 18.48,17.69 19.74,16.43 18.74,15.44 U7.22 | U7.13 17.23,14.69 19.55,17.01 | U7.14 17.24,14.19 U7.65
  Top 0.254: U7.15 16.74,13.69 U7.65 | 19.55,17.01 20.31,17.01 23.29,14.02 23.24,13.97 U7.31 23.24,4.75 v23.22,4.72 | 18.21,17.69 18.24,17.72 U7.60 18.24,22.98 v17.22,24 17.74,23.48 U7.61 17.74,18.59 | 17.74,18.59 17.74,17.91 17.96,17.69 | v68.25,20.37 67.74,20.37 66.06,18.69 59.84,18.69 61.34,20.19 U10.50 | U10.14 55.34,14.19 54.84,13.69 U10.15 | U7.5 17.64,18.69 17.74,18.59 | U8.5 19.1,52.98 | 19.1,52.98 19.63,52.98 20.24,52.37 | U8.7 19.35,51.98 | U10.5 57.74,18.69 57.74,18.21 | 19.1,52.98 17.74,54.34 U8.61 17.74,57.75 | 19.35,51.98 18.24,53.1 U8.60 18.24,57.26 17.74,57.76 17.74,57.75 | U10.65 57.74,17.29 57.74,17.45 | 57.74,17.45 57.74,17.7 | 57.74,17.7 57.74,18.21 | 55.84,23.77 U10.61 55.84,18.43 57.2,17.07 57.36,17.07 57.74,17.45 | 55.84,23.77 55.74,23.88 v55.73,23.88 | 57.74,18.21 58.34,18.82 U10.56 58.34,22.66 58.01,22.99 58.01,24.99 58.6,25.58 60.76,25.58 v60.83,25.5 60.83,24.64 59.87,23.67 59.87,21.41 U10.53 59.84,18.31 58.98,17.45 57.74,17.45 | 57.74,17.7 56.34,19.1 U10.60 56.34,23.27 55.84,23.77 | 57.74,17.45 57.98,17.69 U10.42 68.09,17.69 v68.33,17.93 | 17.74,57.75 17.42,58.06 v17.32,58.06 | U9.56 58.34,57.15 58.04,57.45 58.04,59.41 58.72,60.1 61.11,60.1 v61.26,59.94 61.26,59.12 59.84,57.7 U9.53 59.84,53.95 57.61,51.71 | U8.33 25.26,47.48 26.01,46.74 v26.01,46.46 | U10.33 63.3,13.19 63.65,12.84 63.65,8 v63.22,7.57 | U7.33 25.16,13.19 26.03,12.32 v26.03,12.24 | U8.22 18.74,50.24 19.86,51.36 | 57.15,52.17 58.95,52.17 61.34,54.56 U9.50
  Top 0.381: v53.93,26.99 v53.92,27
  Top 0.508: C59.2 C58.2 C57.1 | C46.1 C42.2 | C36.2 v35.13,54.66 | C63.2 C66.1 | C79.2 C82.1 | v34.82,20.37 C70.2 | C87.2 v42.34,18.24 | C99.2 C102.1 | v73.1,20.37 C89.2 | U6.4 34.29,65.35 v33.91,64.97 | C16.2 v33.91,64.97 | C13.2 32.2,64.97 v33.91,64.97
  Top 0.635: C38.1 C39.2 C40.2 21.45,40.28 v22.68,40.28 | C33.2 C34.2 v5.38,54.25 | C33.2 C28.2 | C28.2 C27.2 v5.38,48.92 | C31.2 C32.2 v12.22,61.32 | C36.2 C35.2 v35.13,53.14 | C65.1 C63.2 v63.96,64.9 | C68.2 C23.2 v5,20.02 | C68.2 C11.2 | C89.2 C90.2 73.08,18.85 v73.1,18.87 | C100.1 v62.53,30.28 | v64.06,30.28 C99.2 C100.1 | v57.38,30.28 C97.2 C96.2 55.73,30.25 v55.75,30.28 | v42.34,16.54 C83.2 C87.2 C88.2 v42.34,19.84 | C84.2 42.39,15.01 v42.34,15.06 | v73.1,20.37 v73.1,18.87 | C95.2 59.84,5.23 v59.82,5.21 | v58.17,5.21 58.19,5.23 C94.2 C93.1 56.67,5.23 v56.64,5.21 | v60.05,69.8 60.05,73.76 U3.EP 60.1,75.95 v60.92,76.77 61.52,77.37 v63.65,77.37 C24.2 | C25.2 54.83,71.73 v54.83,70.06 v54.84,70.05 | C3.2 31.23,73.35 C1.2 | C85.2 73.1,17.32 | C86.2 73.09,17.31 73.1,17.32 | v73.1,18.87 73.1,17.32 | C76.2 v17.63,30.15 | C80.1 24.1,28.72 v24.1,30.15 | v25.73,30.12 C79.2 C81.1 v22.68,30.15 | C82.1 v27.25,30.15 | v50.29,27 C92.2 C91.2 | C91.2 v52.07,27 | v53.93,26.99 C98.1 53.92,25.34 C91.2 | v15.75,27.23 15.76,27.22 C78.1 15.75,25.54 C71.2 C72.2 12.19,27.2 v12.17,27.23 | C68.2 v5.03,18.24 | C11.2 v5.05,16.59 | v5.05,14.78 5.08,14.81 C20.2 C11.2 | v18.16,4.72 C73.1 C74.2 | C74.2 v19.76,4.72 | v21.29,4.72 C75.2 C74.2 | C70.2 C69.2 | C69.2 C21.2 v34.85,17.45 34.82,17.48 | C69.2 34.8,18.85 v34.82,18.87 | v34.82,20.37 v34.82,18.87 | v34.82,18.87 34.82,17.48 | C22.2 34.81,17.46 34.82,17.48 | v73.41,53.14 C54.2 C53.2 v73.41,54.66 v73.41,53.14 | C49.2 73.41,51.61 | v73.41,53.14 73.41,51.61 | 73.41,51.61 73.41,50.43 C50.2 | C60.2 C61.2 v50.27,61.19 | C60.2 51.93,59.64 C62.1 53.68,61.15 v53.67,61.16 | C60.2 v51.92,61.16 | v55.8,64.9 C55.2 C56.2 v57.33,64.9
  Top 0.635: C66.1 v65.48,64.9 | C48.2 v42.95,49.07 42.95,50.32 43.48,50.85 C47.2 C52.2 v42.93,52.5 | C51.2 44.97,54.13 v42.93,54.13 | C58.2 v58.09,39.17 | C59.2 v59.74,39.17 | v24.43,65 C44.1 | C44.1 C42.2 v25.96,65 | C46.1 v27.48,64.97 | v19.25,65 C37.2 C41.2 v17.73,65 | C31.2 C43.1 15.5,61.25 v15.49,61.26 | C31.2 v13.74,61.29 | C28.2 v5.38,50.7 | C33.2 v5.38,52.48 | C30.2 v35.13,51.56 35.13,50.47 34.67,50.01 C29.2 | C26.2 34.15,32.01 v34.14,32 | v22.91,65 C45.1 C44.1 | v60.91,64.9 C64.1 C65.1 | v62.43,64.9 C65.1 | C101.1 C100.1 | C77.2 v19.41,30.15 | C18.2 50.76,67.08 C19.2
  Top 0.762: v45.08,76.33 45.06,76.3 v40.94,76.3 39.13,76.3 C2.2 | C101.1 v60.88,30.28
  other vias: 42.9,76.3 3.53,42.9 3.53,39.09 3.53,35.28 3.53,31.47 77.19,43.54 77.19,39.73 77.19,35.92 77.19,32.11 70.84,39.73 70.84,35.92 70.84,32.11 65.76,3.53 69.57,3.53 39.09,28.93 39.09,32.74 22.58,34.01 13.06,39.09 20.04,68.3 23.85,68.3 4.8,68.3 8.61,68.3 12.42,68.3 16.23,68.3
  pour Top: 36.7,77.34 35.59,76.23 35.59,75.16 37.36,75.16 38.02,75.82 45.42,75.82 45.75,76.15 45.75,77.09 45.49,77.34
  pour Route3: -0.69,82.02 -0.69,74.45 2.54,71.22 15.98,71.22 17.14,72.39 17.14,79.55 14.68,82.02
  pour Route3: 35.33,75.97 35.33,68.76 34.59,68.02 30.43,68.02 29.87,67.46 29.87,65.33 30.96,64.24 51.49,64.24 54.43,67.18 60.48,67.18 61.52,68.22 61.52,72.03 65.84,76.35 69.29,76.35 70,75.64 70,69.7 77.9,61.8 80.42,61.8 83.62,65 83.62,78.97 80.21,82.37 64.19,82.37 59.72,77.9 59.72,71.32 58.72,70.33 56.13,70.33 55.52,70.94 55.52,73 51.18,77.34 36.7,77.34
  pour Route14: -0.69,82.02 -0.69,74.45 2.54,71.22 15.98,71.22 17.14,72.39 17.14,79.55 14.68,82.02
  pour Route14: 64.19,82.37 80.21,82.37 83.62,78.97 83.62,65 80.42,61.8 77.9,61.8 72.52,67.18 54.43,67.18 53.34,68.28 53.34,69.62 51.66,71.3 48.18,71.3 46.74,72.75 46.74,74.45 45.69,75.49 38.81,75.49 36.37,73.05 35.59,73.05 35.33,73.3 35.33,75.97 36.7,77.34 51.18,77.34 55.52,73 55.52,70.94 56.13,70.33 58.72,70.33 59.72,71.32 59.72,77.9
  pour Route2: -1.3,80.44 0.28,82.02 81.38,82.02 82.75,80.65 82.75,0.89 80.59,-1.27 0.41,-1.27 -1.3,0.43
  pour Route15: 0.71,83.01 -2.77,79.53 -2.77,1.6 0.56,-1.73 81.51,-1.73 83.29,0.05 83.29,81.2 81.48,83.01
  pour Bottom: -2.64,79.48 -2.64,1.55 0.23,-1.32 81.05,-1.32 83.21,0.84 83.21,79.76 80.85,82.12 0,82.12
  pour Top: -2.39,80.04 -2.39,0.99 -0.28,-1.12 81.69,-1.12 82.85,0.05 82.85,79.15 79.76,82.25 72.01,82.25 70.31,80.54 70.31,69.19 69.52,68.4 63.12,68.4 60.73,70.79 38.86,70.79 38.43,70.36 38.43,67.13 38.15,66.85 32.72,66.85 32.41,66.55 30.45,66.55 30.43,66.52 29.64,67.31 29.64,70.89 27.36,73.18 19.71,73.18 18.21,74.68 18.21,78.46 14.76,81.91 -0.51,81.91
  pour Top: 28.7,75.31 26.57,73.18 25.93,73.18 25.45,72.69 25.45,72.36 27.58,70.23 29.11,70.23 31.5,72.62 31.5,75.31
  pour Top: 61.67,81.66 67.82,81.66 69.72,79.76 69.72,76.99 69.01,76.28 65.91,76.28 64.62,74.98 63.14,74.98 62.53,74.37 59.74,74.37 59.74,79.73
  pour Top: 43.76,77.34 51.16,77.34 53.49,75.01 54.33,74.17 55.3,74.17 55.3,71.35 55.27,71.32 47.35,71.32 46.84,71.83 46.84,74.85 46.02,75.67 45.87,75.82 44.32,75.82 44.02,75.82 43.64,76.2 43.54,76.3 43.54,76.96 43.54,77.11
  pour Top: 35.33,74.55 35.33,73.15 35.18,73 35.18,70.48 35.43,70.23 37.57,70.23 37.67,70.33 37.95,70.61 37.95,71.12 37.72,71.35 37.36,71.35 36.04,72.67 36.04,74.7 35.48,74.7
GND9  (via drill 0.35)
  other vias: 68.94,64.49
IOVDD  (via drill 0.35)
  Top 0.254: U1.1 37.22,73.93 37.46,74.17 37.46,74.42 37.31,74.58 U1.2 39.1,74.58 C2.1 | U8.55 20.77,55.7 v20.77,58.26 v20.78,58.27 21.24,57.8 U8.54 | U9.55 58.84,58.36 v59.41,58.93 59.34,58.86 U9.54 | U7.55 20.74,24.09 v21.03,24.38 21.03,24.36 21.24,24.15 U7.54 | C74.1 19.74,7.91 U7.24 | U10.55 58.84,24.09 v59.11,24.35 v59.11,24.36 59.34,24.12 U10.54 | U10.24 57.84,10.34 58.04,10.13 58.04,8.39 C94.1 | C58.1 57.84,42.57 U9.24 | C39.1 19.74,41.74 U8.24
  Top 0.508: C94.1 C95.1
  Top 0.635: C39.1 C40.1 21.45,41.58 v22.66,41.58 | C94.1 59.79,8.24 v59.79,9.98 | Y1.P$1 35.86,34.94 v35.86,35 | R14.2 v70.59,11 | C26.1 35.76,33.49 Y1.P$4 | v21.29,9.4 C75.1 C74.1 | v32.26,11.07 30.64,11.07 R6.2 | v59.74,43.87 C59.1 C58.1
  Top 0.762: Y1.P$1 Y1.P$4 | R23.2 v29.95,41.45 | R24.2 69.58,43.12 v69.6,43.1
  other vias: 44.65,72.69 39.57,72.69 44.65,74.14 37.87,72.67
  pour Top: 38.4,75.06 45.34,75.06 45.97,74.42 45.97,72.26 45.47,71.75 37.47,71.75 36.42,72.8 36.42,74.65 38,74.65
  pour Route14: -4.65,63.4 2.57,70.61 28.57,70.61 29.64,69.55 29.64,68.38 30.35,67.67 34.34,67.67 35.26,68.58 35.26,69.47 36.58,70.79 51.18,70.79 52.65,69.32 52.65,67.79 54.1,66.34 72.44,66.34 81.69,57.1 81.69,0.63 78.71,-2.34 -1.22,-2.34 -4.65,1.09
  pour Route14: 39.01,75.06 45.34,75.06 45.92,74.47 45.92,72.31 47.8,70.43 47.62,70.26 37.85,70.26 36.68,69.09 35.41,69.09 35.26,69.24 35.26,71.3
N$3
  Top 0.254: U1.5 33.5,74.58 33.15,74.93 C3.1
N$10
  Top 0.254: U3.5 56.33,73.81 C67.1
N$15
  Top 0.254: U7.23 19.24,9.96 18.16,8.88 C73.2
N$16
  Top 0.254: U7.59 18.74,24.54 17.73,25.55 C78.2
N$17
  Top 0.254: U7.51 22.74,22.49 25.73,25.48 C79.1
N$18
  Top 0.254: U7.49 23.74,22.34 27.25,25.86 C82.2
N$23
  Top 0.254: U10.23 57.37,12.47 57.37,9.61 56.68,8.93 56.68,8.26 C93.2
N$24
  Top 0.254: U10.59 56.84,24.52 56.01,25.35 C98.2
N$25
  Top 0.254: U10.51 60.84,22.49 64.06,25.7 C99.1
N$26
  Top 0.508: U6.6 R15.1
N$27
  Top 0.254: U10.49 61.84,22.34 65.58,26.09 C102.2
N$39
  Top 0.254: U9.23 57.34,44.35 56.44,43.44 C57.2
N$41
  Top 0.254: U8.59 18.74,58.27 17.53,59.49 C43.2
N$43
  Top 0.254: C38.2 18.39,43.64 19.24,44.49 U8.23
N$44
  Top 0.254: U8.49 23.74,56.73 27.5,60.49 27.48,60.5 C46.2
N$47
  Top 0.254: U8.51 22.74,56.78 25.96,59.99 C42.1
N$57
  Top 0.254: C62.2 55.75,59.64 56.84,58.55 U9.59
N$61
  Top 0.254: U9.51 60.84,56.57 63.96,59.69 C63.1
N$64
  Top 0.254: U9.49 61.84,56.63 65.48,60.27 C66.2
RESET  (via drill 0.35)  (1 unrouted)
  Top 0.254: U8.36 26.56,48.98 29.95,45.59 R23.1 32.47,45.53 33.99,44.02 41.17,44.02 JP5.8 | U9.36 64.61,48.98 66.98,46.61 66.98,45.48 R24.1 v69.6,44.82 | U7.36 26.56,14.69 28.92,12.33 R6.1 28.92,10.03 29.59,9.36 32.25,9.36 | U10.36 64.66,14.69 65.96,13.39 v65.96,11.02 | 32.26,9.35 32.25,9.36 | 32.25,9.36 32.45,9.36 34.06,10.97 43.74,10.97 JP4.2
  Top 0.889: v65.96,11.02 67.27,11.02 R14.1
  Bottom 0.254: v65.96,11.02 51.89,11.02 50.19,9.32 JP4.2 | JP5.8 42.85,42.39 45.27,44.82 v69.6,44.82
SCLK  (via drill 0.35)  (1 unrouted)
  Top 0.254: U8.19 17.24,45.87 15.27,43.89 v14.12,43.89 | U9.19 55.34,45.56 53.92,44.15 49.73,44.15 JP5.5 | U7.19 17.24,11.27 15.34,9.37 v13.59,9.37 | U10.19 55.34,11.07 51.07,6.79 45.4,6.79 JP4.4
  Bottom 0.254: v14.12,43.89 38.48,43.89 41.3,41.07 44.12,41.07 JP5.5 | v13.59,9.37 13.59,7.75 14.43,6.91 40.41,6.91 41.55,8.05 44.12,8.05 JP4.4
SDI  (via drill 0.35)  (1 unrouted)
  Top 0.254: U8.20 17.74,45.58 14.78,42.62 v14.12,42.62 | U9.20 55.84,45.07 54.17,43.4 51.98,43.4 45.85,37.26 JP5.3 44.15,38.51 39.17,38.51 37.97,39.7 v37.97,42.65 | U7.20 17.74,10.81 v15.14,8.2 | U10.20 55.84,10.48 50.88,5.51 41.22,5.51 39.95,6.78 39.95,8.36 40.92,9.32 JP4.1
  Bottom 0.254: v15.14,8.2 39.8,8.2 40.92,9.32 JP4.1 | v14.12,42.62 14.78,42.62 14.81,42.65 v37.97,42.65
SDO_0  (via drill 0.35)
  Top 0.254: U8.21 18.24,44.91 16.54,43.21 v16.54,41
  Bottom 0.254: JP5.4 42.77,37.34 38.38,37.34 36.96,38.76 17.7,38.76 16.54,39.93 v16.54,41
SDO_1
  Top 0.254: U9.21 56.34,44.78 46.28,34.72 JP5.1
SDO_2
  Top 0.254: U7.21 18.24,10.06 16.46,8.28 16.46,4.27 17.58,3.15 25.35,3.15 26.44,4.24 JP4.5
SDO_3
  Top 0.254: U10.21 56.34,9.98 50.6,4.24 JP4.6
STARTN
  Top 0.254: JP5.2 42.85,33.4 43.46,32.79 58.06,32.79 63.75,38.48 63.75,47.04 63.31,47.48 U9.33
SYNC_FROM_ADC  (via drill 0.35)
  Top 0.254: U8.35 25.64,48.48 27.53,46.58 v27.53,37.44 36.83,37.44 42.72,31.55 58.88,31.55 v65.02,37.69 65.02,47.19 64.24,47.98 | U9.35 63.74,48.48 64.24,47.98 | 64.24,47.98 U9.34 | U7.35 25.61,14.19 27.48,12.32 27.48,9.47 28.46,8.5 34,8.5 v35.31,9.8 | U10.35 63.51,14.19 64.72,12.98 v64.72,8.66
  Route15 0.254: v64.72,8.66 63.17,10.21 63.17,24.23 66.55,27.61 66.55,36.17 v65.02,37.69
  Bottom 0.254: v27.53,37.44 27.53,32.87 31.19,29.21 36.02,29.21 39.4,25.83 39.4,13.89 v35.31,9.8
VCM_ADC1  (via drill 0.35)
  Top 0.254: U8.57 19.74,59.24 20.5,59.99 v20.83,59.99
  Bottom 0.254: v20.83,59.99 18.34,59.99 14.4,63.93 JP_VCM_OUT.1
VPOS  (via drill 0.35)
  Top 0.152: 33.11,76.36 v32.77,76.71
  Top 0.254: U1.6 34.62,73.91 33.58,73.91 32.82,73.15 C1.1 | U3.4 58.56,74.46 57.33,75.69 v56.85,75.69 v54.79,75.69 | U1.4 34.25,75.23 33.11,76.36 | v32.77,76.71 v30.99,76.71
  Top 0.508: U6.2 33.92,67.89 C16.1
  Top 0.635: C13.1 31.24,67.83 v31.24,69.65
  Top 0.762: C25.1 v57.86,71.75 | C16.1 v33.91,69.65 v31.24,69.65 | v34.16,72.69 33.01,72.69 32.73,72.97
  other vias: 31.01,77.98 32.79,77.98 56.85,77.47 54.81,77.47
  pour Top (no thermals): 59.36,74.37 59.36,76.63 57.91,78.08 54.43,78.08 54.08,77.72 54.08,75.39 54.61,74.85 57.84,74.85 58.32,74.37
  pour Top (no thermals): 59.36,71.83 59.36,73.23 58.14,73.23 57.1,72.19 56.03,72.19 56.03,71.32 58.85,71.32
  pour Top (no thermals): 30.35,78.38 30.35,76.4 30.68,76.07 33.32,76.07 34.24,75.16 34.95,75.16 34.95,76.53 33.58,77.9 33.58,78.21 33.1,78.69 30.66,78.69
  pour Top: 18.77,78.36 18.77,75.11 19.81,74.07 26.42,74.07 28.42,76.07 34.49,76.07 36.25,77.83 51.56,77.83 54.53,74.85 57.53,74.85 58.47,75.79 58.47,79.58 56.44,81.61 22.02,81.61
  pour Route3: 18.77,78.33 18.77,72.9 20.09,71.58 34.62,71.58 34.95,71.91 34.95,76.48 36.25,77.83 51.56,77.83 56.03,73.36 56.03,71.09 56.29,70.84 58.37,70.84 59.36,71.83 59.36,77.95 55.35,81.97 22.4,81.97
  pour Route14: 18.77,78.36 18.77,72.9 20.09,71.58 34.39,71.58 34.95,72.14 34.95,76.48 36.25,77.83 51.56,77.83 56.03,73.36 56.03,71.09 56.29,70.84 58.37,70.84 59.36,71.83 59.36,77.93 54.43,82.85 23.27,82.85
  pour Top: 32.26,73.58 32.26,72.47 30.63,70.84 30.63,67.23 32.41,67.23 32.74,67.56 34.39,67.56 34.7,67.87 34.7,73.48 34.95,73.74 34.95,73.99 32.66,73.99
  pour Route3: 27.66,73 30.63,70.03 30.63,68.96 30.96,68.63 34.16,68.63 34.57,69.04 34.57,71.5 32.56,73.51 28.04,73.51 27.66,73.13
  pour Route14: 27.66,73 30.63,70.03 30.63,68.96 30.96,68.63 34.16,68.63 34.57,69.04 34.57,72.11 33.17,73.51 28.04,73.51 27.66,73.13
VREF  (via drill 0.35)
  Top 0.254: U8.41 29.49,51.49 30.96,50.01 v31.67,50.01 | U8.8 11.18,51.48 10.41,50.72 v10.41,50.7 | U9.41 67.59,51.49 69.09,49.99 v69.98,49.99 | U7.41 29.57,17.19 30.93,15.82 v31.9,15.82 | v70.03,15.65 69.03,15.65 67.49,17.19 U10.41 | v9.78,16.61 10.36,17.19 U7.8 | U10.8 48.28,17.19 v47.65,16.56 | v48.13,50.85 48.76,51.48 U9.8
  Top 0.508: C18.1 49.46,67.08 C19.1 | C83.1 C84.1
  Top 0.635: C86.1 71.77,15.65 v70.03,15.65 70.03,17.31 C85.1 | v47.65,16.56 45.81,16.56 C83.1 | v9.78,16.61 8.52,16.61 C11.1 C20.1 | C22.1 31.93,15.8 | 31.93,15.8 31.8,15.8 31.91,15.91 C21.1 | 31.93,15.8 v31.9,15.82 | C50.1 71.61,49.99 v69.98,49.99 69.96,50 C49.1 | v48.13,50.85 C47.1 C48.1 | v10.41,50.7 C28.1 C27.1 | C29.1 v31.67,50.01 31.67,51.55 C30.1 | C18.1 VREF.1 46.51,66.64 R15.2
  Top 0.762: R15.2 49.01,66.62 C19.1
  Bottom 0.254: v31.9,15.82 12.24,15.82 11.46,16.61 v9.78,16.61 9.73,16.66 9.73,31.72 8.89,32.56 8.89,49.17 v10.41,50.7 11.2,51.49 29.49,51.49 30.96,50.01 v31.67,50.01 33.02,51.36 33.02,54.71 34.57,56.26 36.58,56.26 39.17,58.85 39.17,61.72 VREF.1 46.51,69.04 47.58,67.97 47.58,51.41 v48.13,50.85 48.77,51.49 67.59,51.49 69.09,49.99 v69.98,49.99 71.98,49.99 74.64,47.33 74.64,30.49 76.2,28.93 76.2,19.25 72.59,15.65 v70.03,15.65 69.04,15.65 67.49,17.2 48.49,17.2 47.85,16.56 v47.65,16.56
XTAL_OUT  (via drill 0.35)
  Top 0.254: U8.32 23.77,46.76 23.77,45.37 26.09,43.05 26.09,36.47 30.56,32 v32.38,32 | U9.32 v61.84,42.17 v61.85,42.16 | U7.32 23.74,11.51 25.5,9.74 v25.52,9.74 | v61.85,9.3 v61.84,9.31 U10.32
  Top 0.635: Y1.P$3 v32.38,32
  Route15 0.254: v32.38,32 32.38,31.45 24.54,23.6 24.54,10.73 v25.52,9.74 27.7,7.56 36.36,7.56 40.28,11.48 60.71,11.48 61.85,10.34 v61.85,9.3
  Bottom 0.254: v61.85,42.16 61.85,38.25 54.56,30.96 33.12,30.96 32.38,31.7 v32.38,32

### Text on the board
tDocu: VPOS | GND | VREF | ADC board v4 (The Tower) / Mid Board / Enrico Ravagli 2025